# EAGLE board foxBMS_BMS-Slave_12cell (EAGLE 6.5.0), part 1 of 3
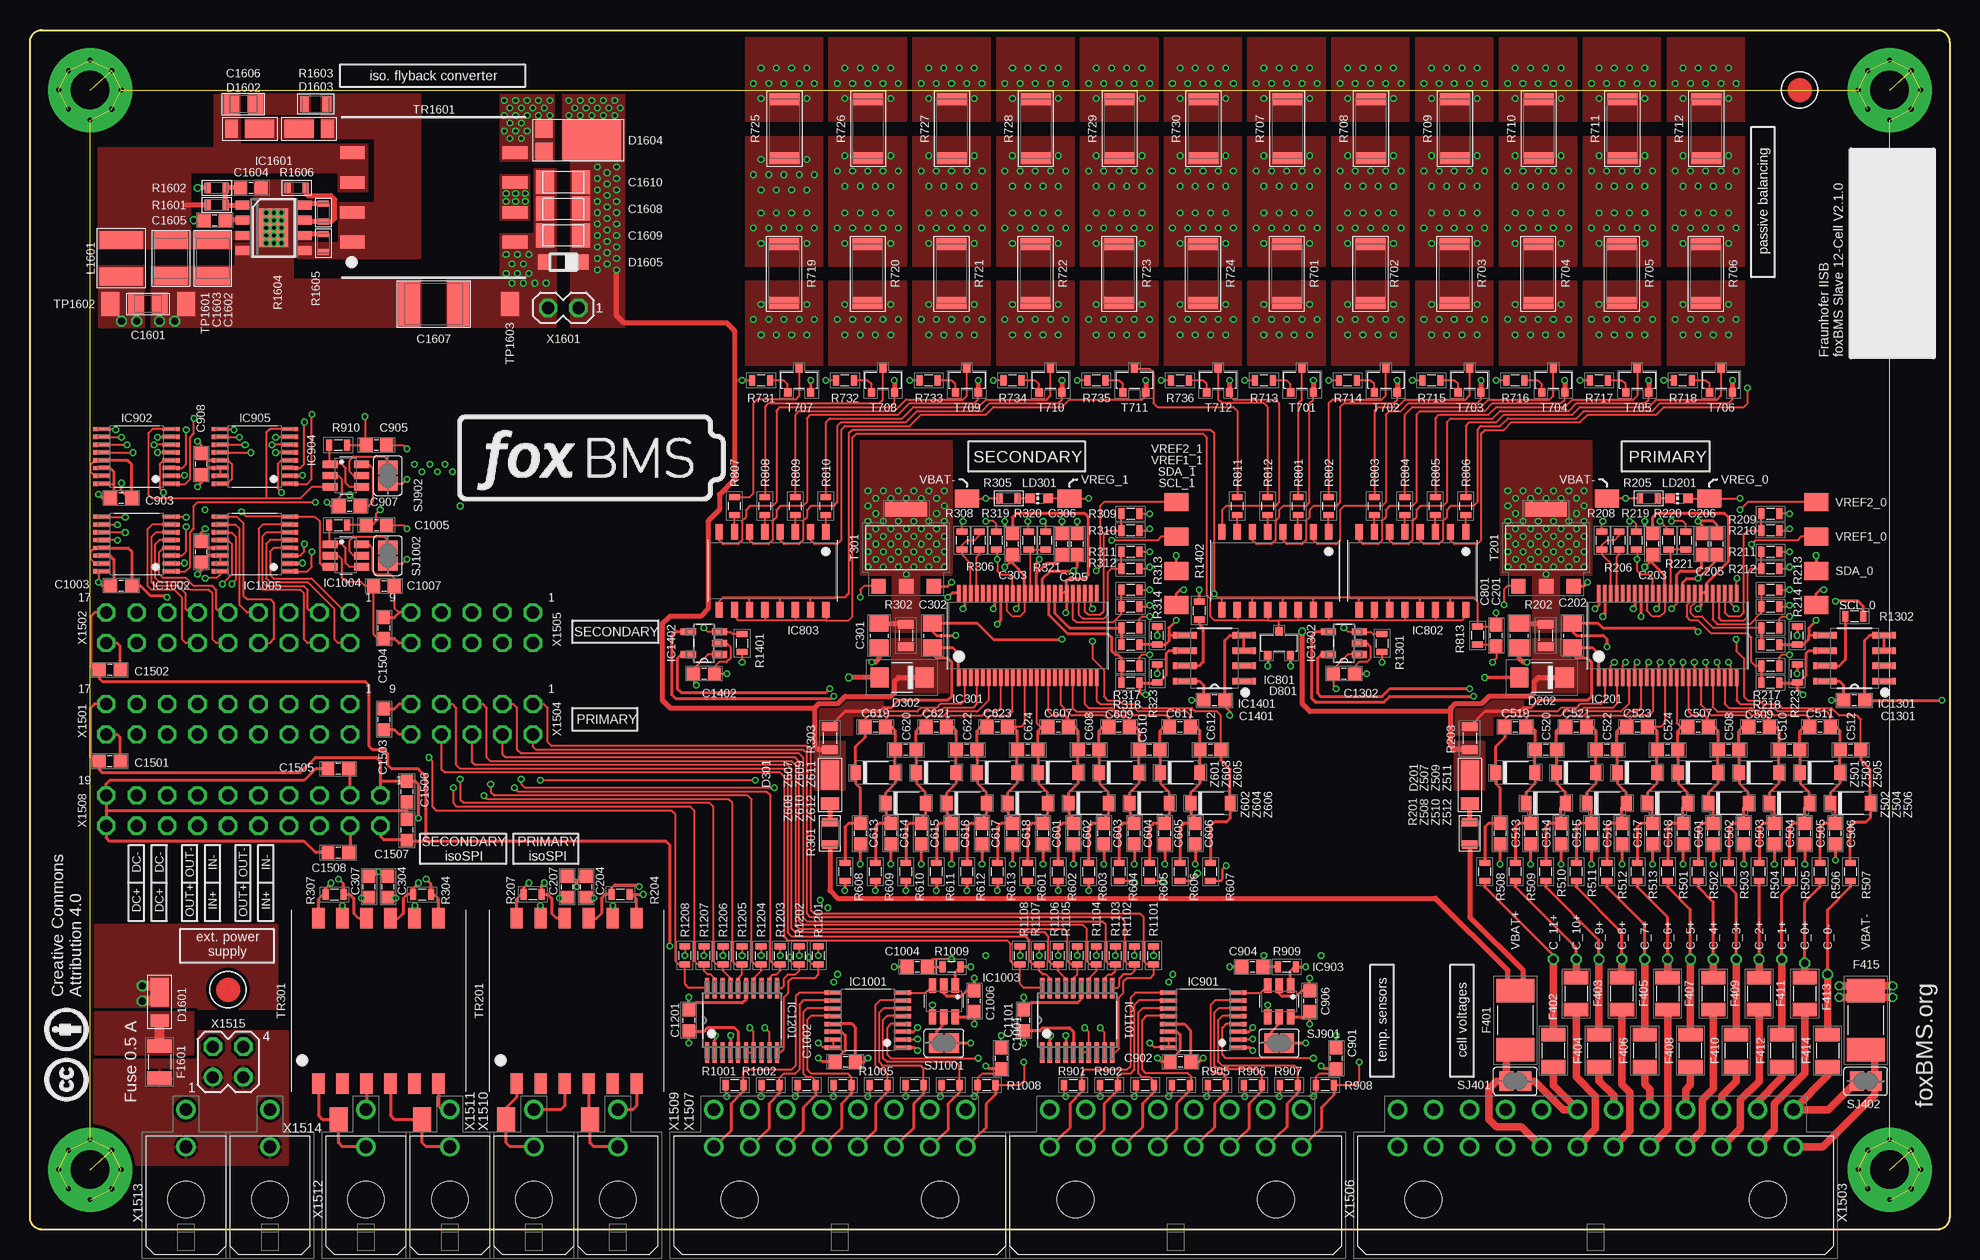
[diagram p24: board, top side]
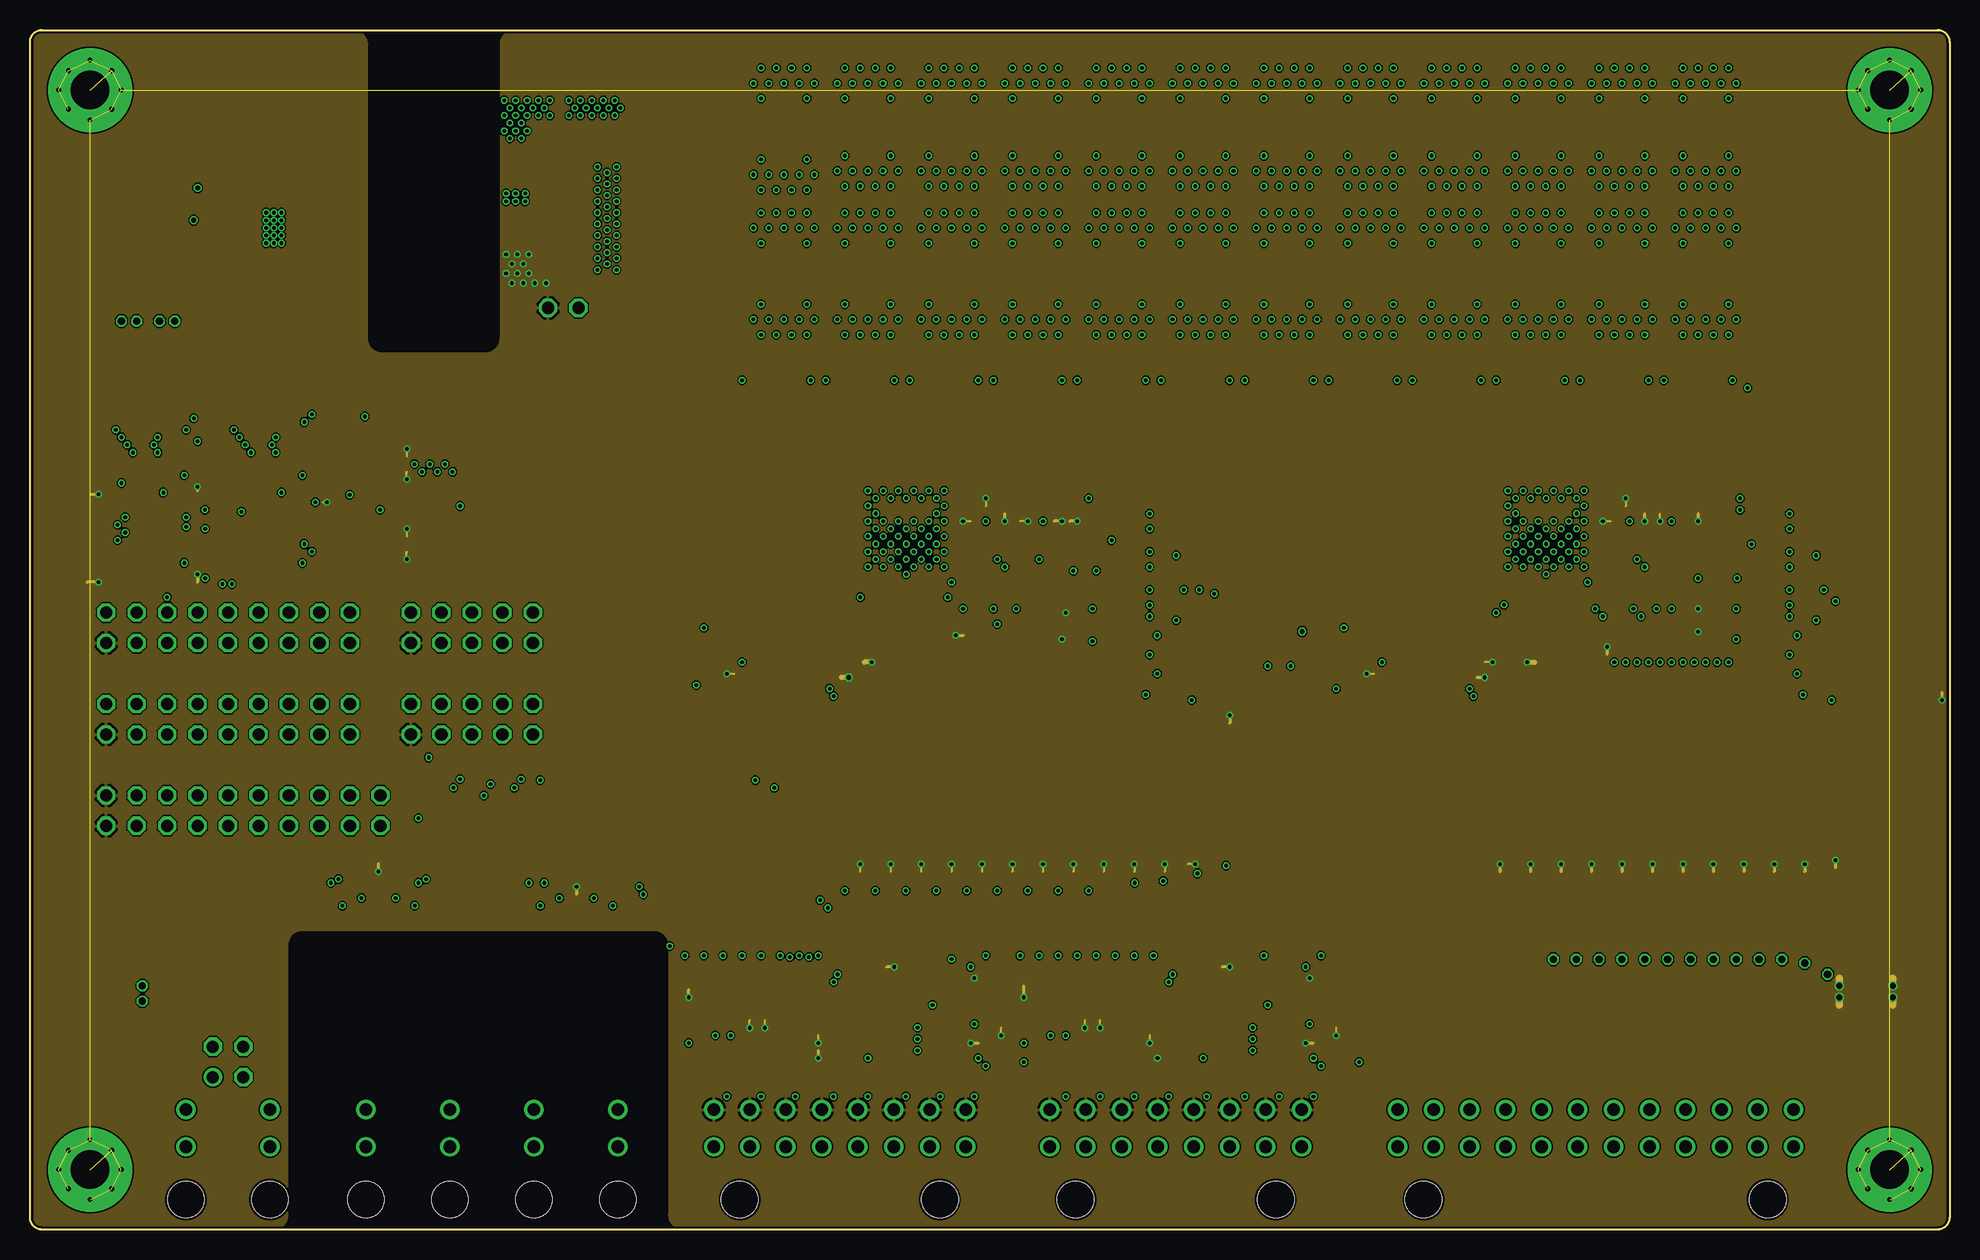
[diagram p25: board, inner layer FUSED_VBAT-]
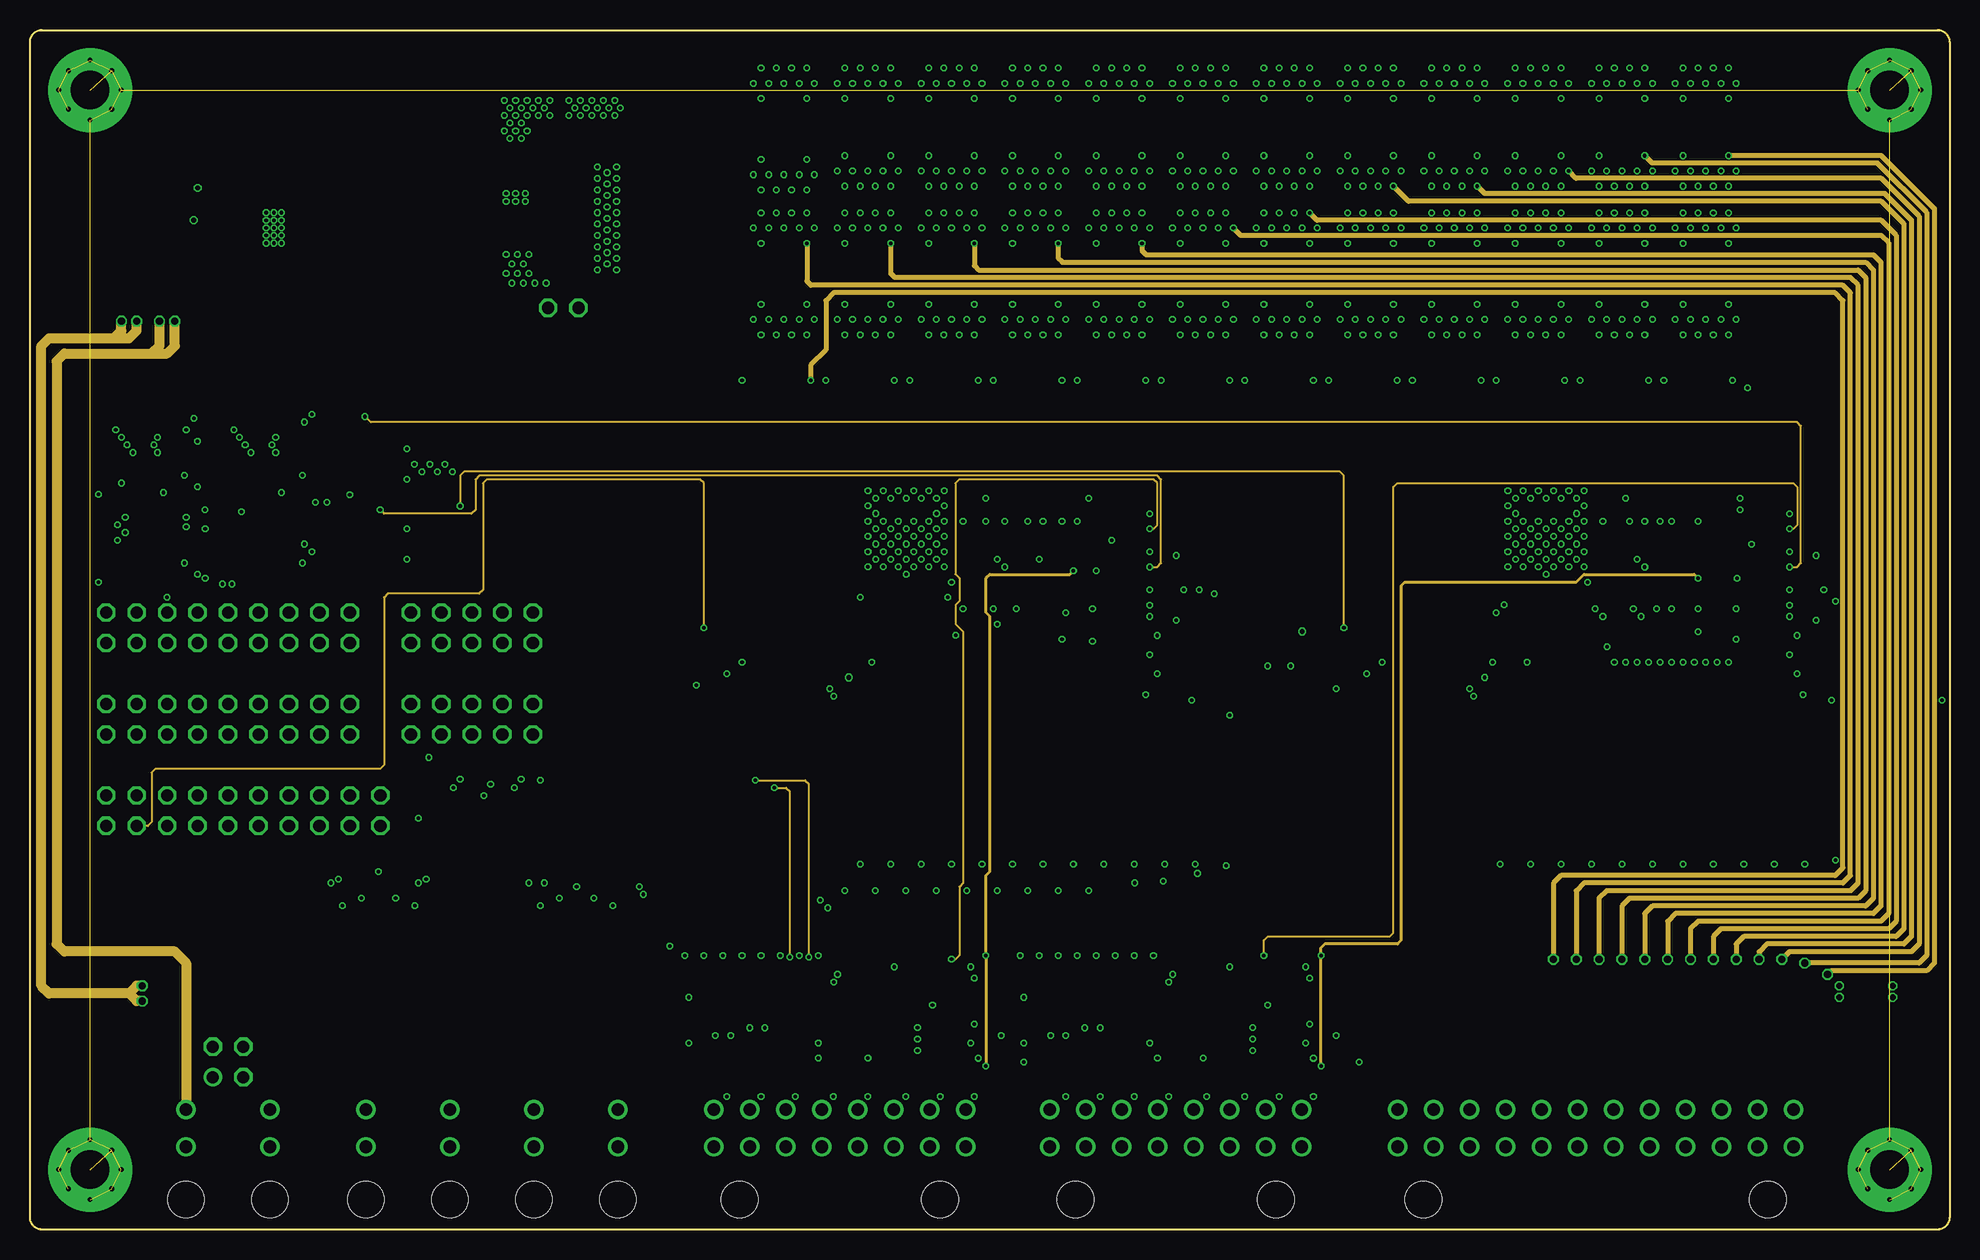
[diagram p26: board, inner layer Signals1]
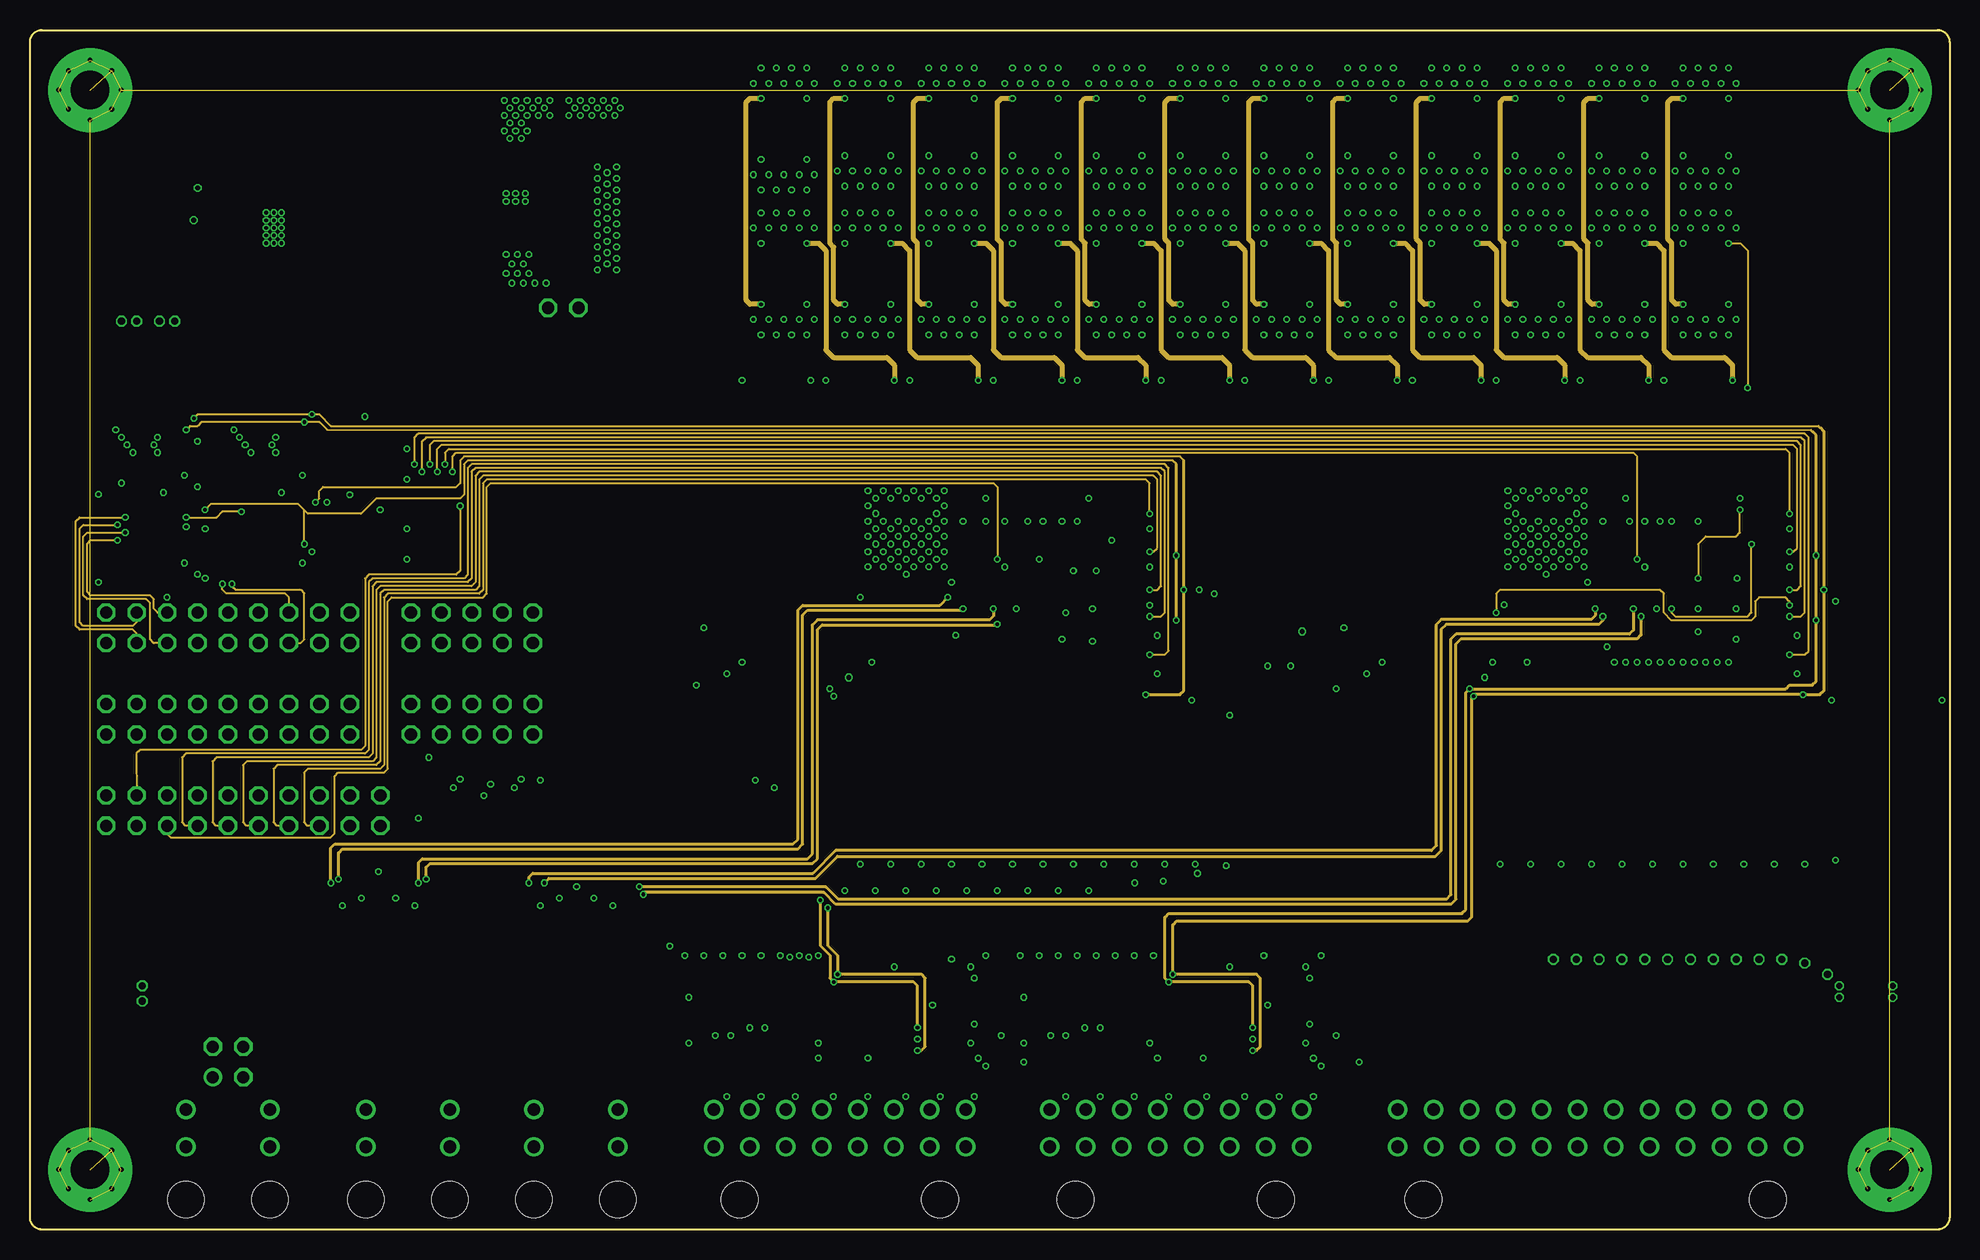
[diagram p27: board, inner layer Signals2]
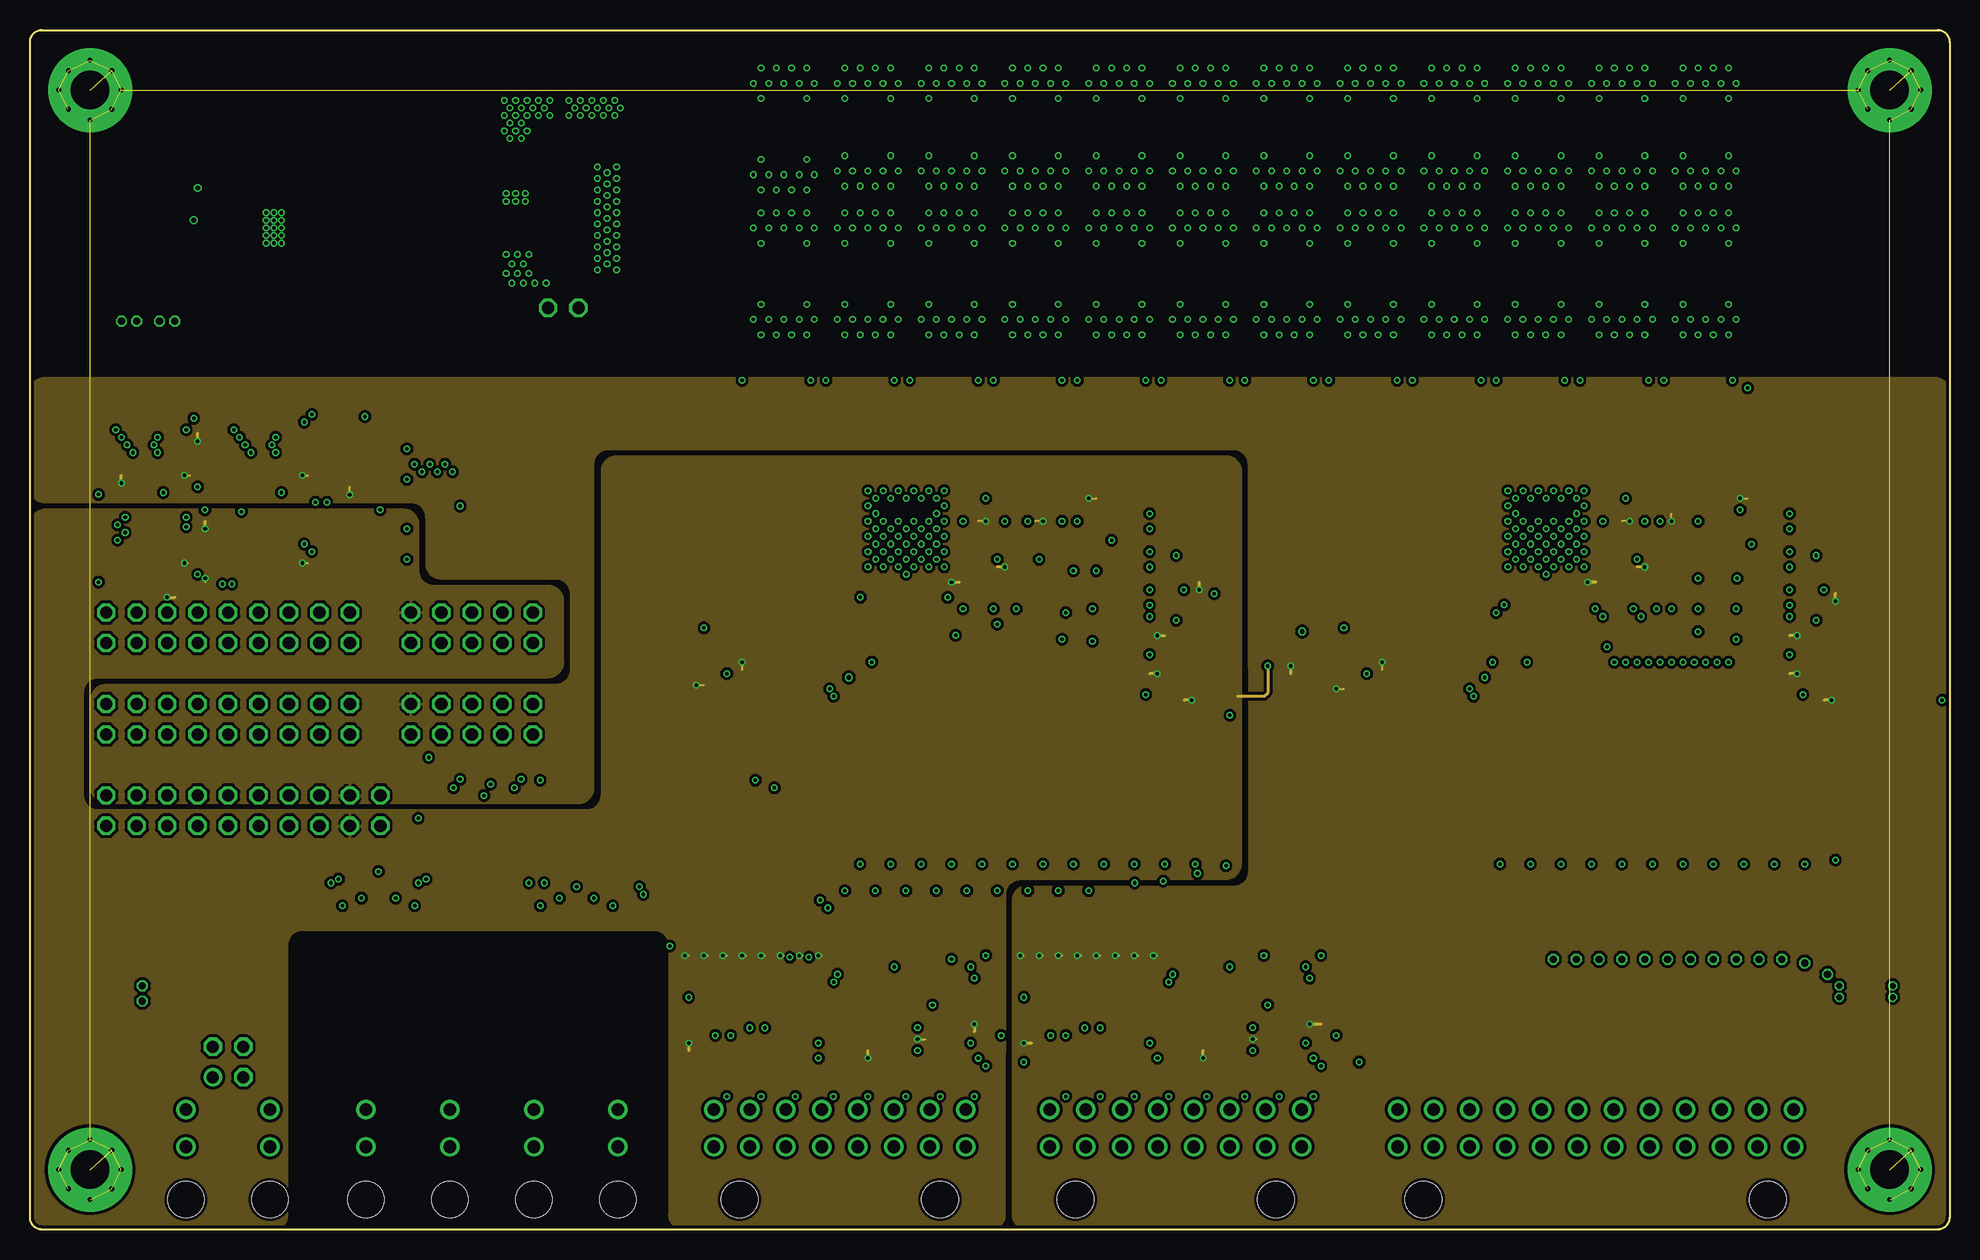
[diagram p28: board, inner layer V_REG]
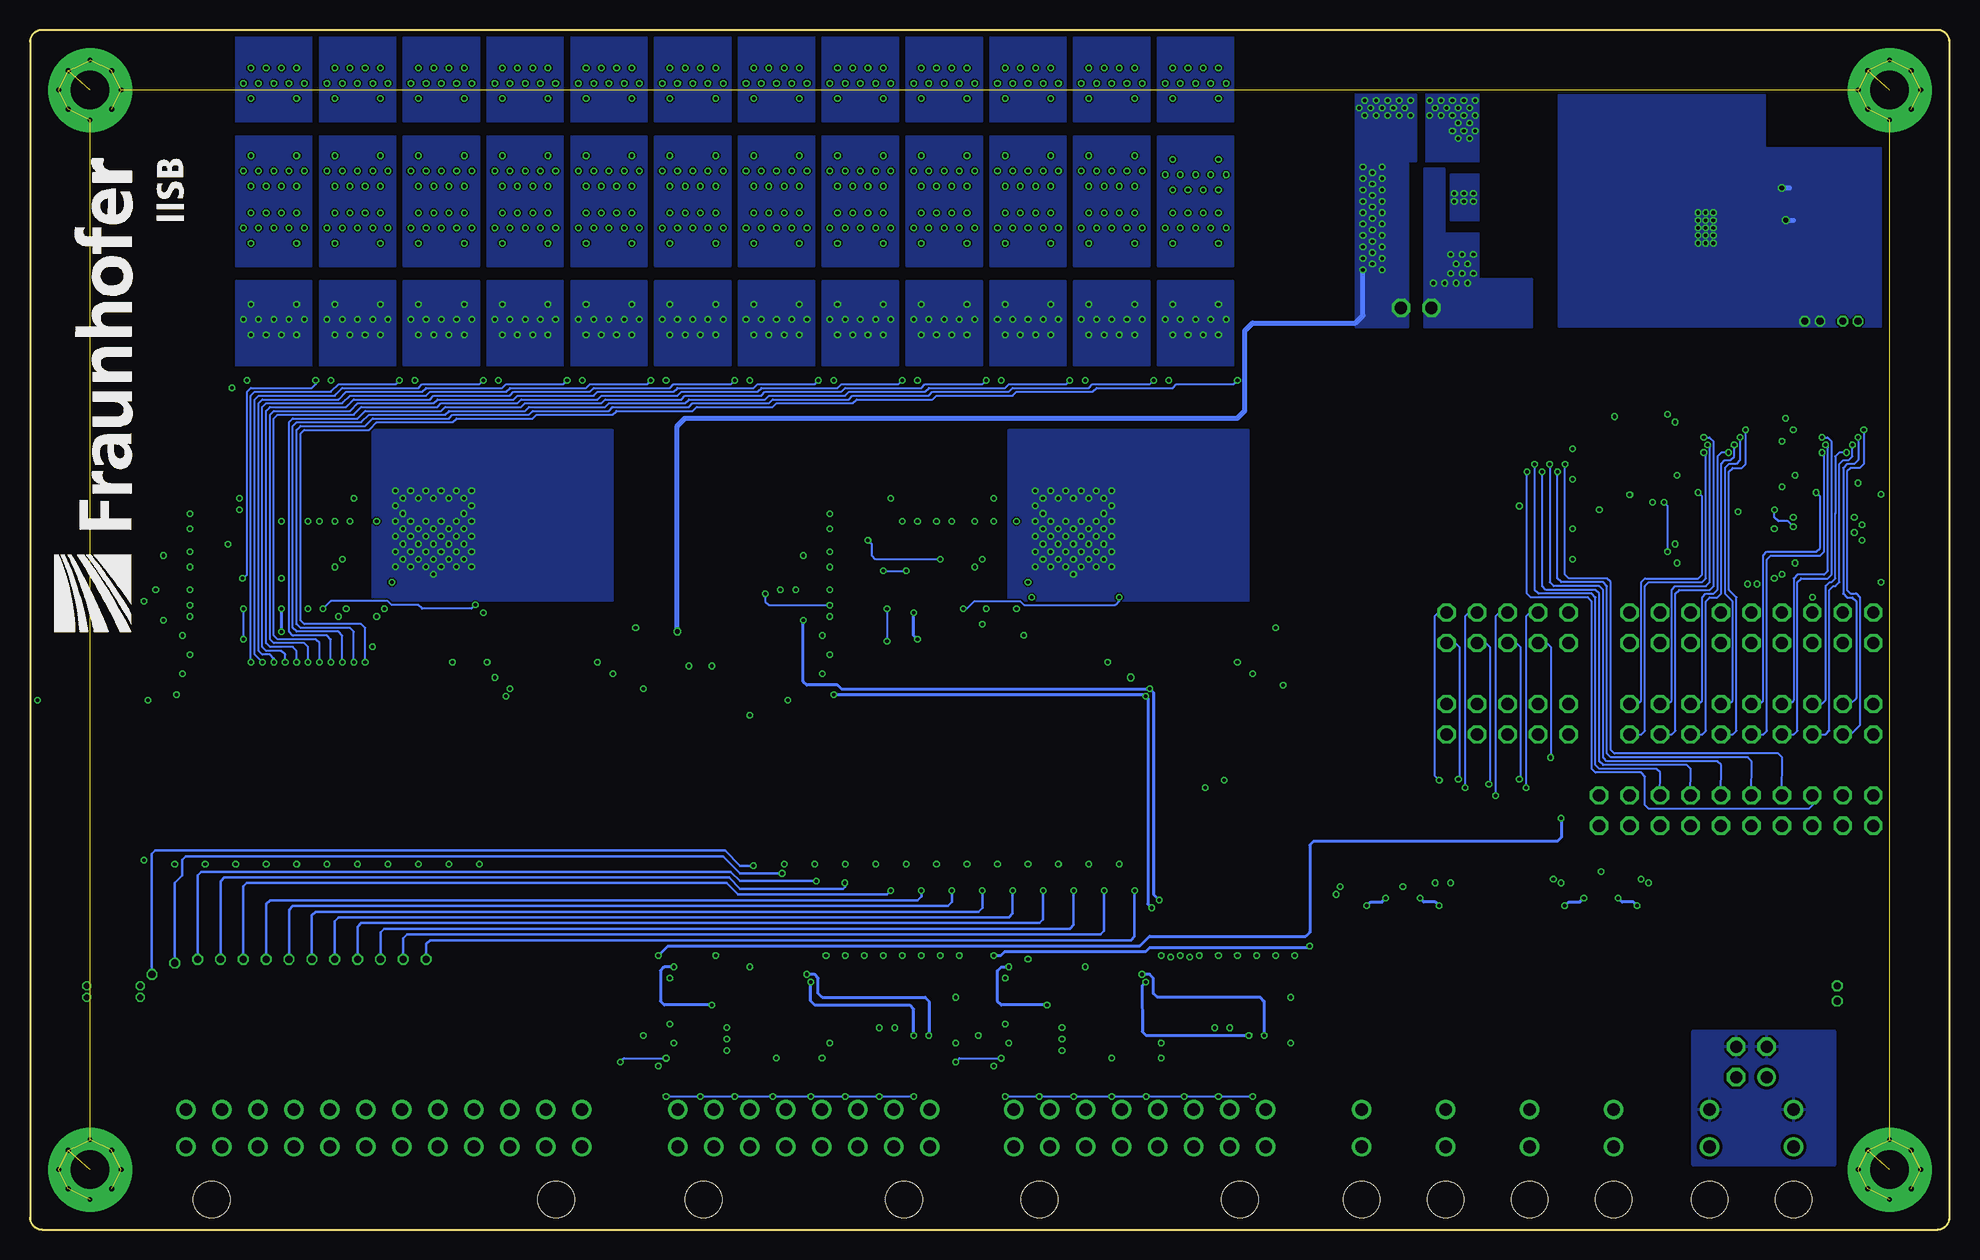
[diagram p29: board, bottom side, seen from below]

Size 160 x 100 mm. Coordinates in mm from the lower left corner, seen from the top.
Outline: 1,100 159,100 arc-90 160,99 160,1 arc-90 159,0 1,0 arc-90 0,1 0,99 arc-90 1,100
Copper layers (1+2*3+4*5+16): Top 0.035mm / dielectric 0.3mm / FUSED_VBAT- 0.035mm / dielectric 0.2mm / Signals1 0.035mm / dielectric 0.3mm / Signals2 0.035mm / dielectric 0.2mm / V_REG 0.035mm / dielectric 0.3mm / Bottom 0.035mm
Design rules "Multi-CB_6L_125um-Tracks_OL35um-IL35um": minimum track width 0.125mm, minimum drill 0.2mm, track to track 0.125mm, track to pad 0.125mm, pad to pad 0.125mm, via to via 0.125mm, smd to smd 0mil, copper to edge 0.2mm, drill to drill 0.2mm, minimum pad ring 0.125mm, minimum via ring 0.125mm, stop-mask expansion 2mil, vias tented up to drill 0.45mm, thermal gap 0.2mm
Net classes: 1 DiffPair: width 0.254 mm
tKeepout: area 153,3 to 157,7; area 3,3 to 7,7; area 151,91 to 159,99; area 3,93 to 7,97; area 155,0 to 160,100; area 0,0 to 5,100; area 5,95 to 155,100

## Footprints (pad centres in the part's own frame; a part is rotated, then mirrored left to right if it is on the bottom)
C_SMD_0805_(2012)_R_MULTICOMP_REV01 = smd 1.3 x 1.6: P$1 -1,0; P$2 1,0
C_SMD_0603_(1608)_R_KEMET_REV01 = smd 1.08 x 1.05: 1 -0.865,0; 2 0.865,0
C_SMD_0805_(2012)_R_KEMET_REV01 = smd 1.3 x 1.6: P$1 -1,0; P$2 1,0
1210 = smd 1.5 x 2.9: P$1 -1.5,0; P$2 1.5,0
1812 = smd 1.8 x 3.7: P$1 -2.05,0; P$2 2.05,0
C_SMD_1206_(3216)_R_KEMET_REV01 = smd 1.5 x 2: P$1 -1.5,0; P$2 1.5,0
POWER_DI_123 = smd 1.5 x 1.05: A 0,-1 | smd 1.5 x 2.4: K 0,1.375
D_SMD_SMA_(DO-214AC)_(BIDIR)_R_VISHAY_REV01 = smd 1.52 x 1.68: A -1.88,0; C 1.88,0
D_SMD_SOT23_(TO-236AB)_R_NXP_REV01 = smd 0.6 x 0.7: 1 -0.95,-1; 2 0.95,-1; 3 0,1
POWER_DI_5 = smd 1.4 x 1.4: A1 -0.92,-3.175; A2 0.92,-3.175 | smd 3.36 x 4.86: K 0,0.807
SOD123 = smd 0.914 x 1.219: A 1.646,0; C -1.646,0
448_SERIES_LITTELFUSE = smd 1.96 x 3.15: P$1 -2.45,0; P$2 2.45,0
R_SMD_CHIP_1206_R_LITTLEFUSE_REV_01 = smd 1.14 x 2.03: P$1 -1.35,0; P$2 1.335,0
0_LES_BATTERIE-MANAGEMENT.SMD_IC_SMD_SSOP-48_(G48)_R_LINEAR_REV01 = smd 0.295 x 1.37: 1 -5.75,-3.535; 2 -5.25,-3.535; 3 -4.75,-3.535; 4 -4.25,-3.535; 5 -3.75,-3.535; 6 -3.25,-3.535; 7 -2.75,-3.535; 8 -2.25,-3.535; 9 -1.75,-3.535; 10 -1.25,-3.535; 11 -0.75,-3.535; 12 -0.25,-3.535; 13 0.25,-3.535; 14 0.75,-3.535; 15 1.25,-3.535; 16 1.75,-3.535; 17 2.25,-3.535; 18 2.75,-3.535; 19 3.25,-3.535; 20 3.75,-3.535; 21 4.25,-3.535; 22 4.75,-3.535; 23 5.25,-3.535; 24 5.75,-3.535; 25 5.75,3.535; 26 5.25,3.535; 27 4.75,3.535; 28 4.25,3.535; 29 3.75,3.535; 30 3.25,3.535; 31 2.75,3.535; 32 2.25,3.535; 33 1.75,3.535; 34 1.25,3.535; 35 0.75,3.535; 36 0.25,3.535; 37 -0.25,3.535; 38 -0.75,3.535; 39 -1.25,3.535; 40 -1.75,3.535; 41 -2.25,3.535; 42 -2.75,3.535; 43 -3.25,3.535; 44 -3.75,3.535; 45 -4.25,3.535; 46 -4.75,3.535; 47 -5.25,3.535; 48 -5.75,3.535
OC_SMD_SOIC-16_R_AVAGO_REV01 = smd 0.6 x 1.3: 1 -4.445,-3.24; 2 -3.175,-3.24; 3 -1.905,-3.24; 4 -0.635,-3.24; 5 0.635,-3.24; 6 1.905,-3.24; 7 3.175,-3.24; 8 4.445,-3.24; 9 4.445,3.24; 10 3.175,3.24; 11 1.905,3.24; 12 0.635,3.24; 13 -0.635,3.24; 14 -1.905,3.24; 15 -3.175,3.24; 16 -4.445,3.24
SOP65P638X110-16N = smd 1.422 x 0.356: 1 -2.896,2.286; 2 -2.896,1.626; 3 -2.896,0.965; 4 -2.896,0.33; 5 -2.896,-0.33; 6 -2.896,-0.965; 7 -2.896,-1.626; 8 -2.896,-2.286; 9 2.896,-2.286; 10 2.896,-1.626; 11 2.896,-0.965; 12 2.896,-0.33; 13 2.896,0.33; 14 2.896,0.965; 15 2.896,1.626; 16 2.896,2.286
IC_SMD_TSOT-23-6_(S6)_R_LINEAR_REV01 = smd 0.62 x 1.22: 1 -0.95,-1.31; 2 0,-1.31; 3 0.95,-1.31; 4 0.95,1.31; 5 0,1.31; 6 -0.95,1.31
SOP65P640X150-20N = smd 1.702 x 0.356: 1 -2.692,2.921; 2 -2.692,2.286; 3 -2.692,1.626; 4 -2.692,0.965; 5 -2.692,0.33; 6 -2.692,-0.33; 7 -2.692,-0.965; 8 -2.692,-1.626; 9 -2.692,-2.286; 10 -2.692,-2.921; 11 2.692,-2.921; 12 2.692,-2.286; 13 2.692,-1.626; 14 2.692,-0.965; 15 2.692,-0.33; 16 2.692,0.33; 17 2.692,0.965; 18 2.692,1.626; 19 2.692,2.286; 20 2.692,2.921
SOIC127P600X175-8N = smd 1.981 x 0.533: 1 -2.464,1.905; 2 -2.464,0.635; 3 -2.464,-0.635; 4 -2.464,-1.905; 5 2.464,-1.905; 6 2.464,-0.635; 7 2.464,0.635; 8 2.464,1.905
SOT95P280X145-5N = smd 1.27 x 0.559: 1 -1.295,0.94; 2 -1.295,0; 3 -1.295,-0.94; 4 1.295,-0.94; 5 1.295,0.94
S8E = smd 0.76 x 1.143: 1 -1.905,-2.602; 2 -0.635,-2.602; 3 0.635,-2.602; 4 1.905,-2.602; 5 1.905,2.602; 6 0.635,2.602; 7 -0.635,2.602; 8 -1.905,2.602 | smd 3.2 x 2.4: P$1 0,0
WE-LQS = smd 1.5 x 3.6: 1 -1.525,0; 2 1.525,0
CHIP-LED0603 = smd 0.8 x 0.8: A 0,-0.75; C 0,0.75
R_SMD_0805_R_VISHAY_REV01 = smd 0.7 x 1.3: 1 -0.95,0; 2 0.95,0
R_SMD_0603_R_VISHAY_REV01 = smd 0.5 x 0.9: 1 -0.75,0; 2 0.75,0
R_SMD_2010_R_YAGEO_REV01 = smd 1 x 2.5: P$1 -2.45,0; P$2 2.45,0
SJ = smd 1.168 x 1.6: 1 -0.762,0; 2 0.762,0
CUSTOM_JUMPER_SJ = smd 1.168 x 1.6: 1 -0.66,0; 2 0.66,0
D_SMD_SOT223_(SC-73)_R_NXP_REV01 = smd 1.2 x 1.2: 1 -2.3,-3.2; 2 0,-3.2; 3 2.3,-3.2 | smd 3.5 x 1.2: 4 0,3.2
CUSTOM_PAD_PAD2.0X1.5MM = smd 2 x 1.5: P$1 0,0
HM2102NL = smd 1.02 x 1.71: 1 -5,-6.89; 2 -3,-6.89; 3 -1,-6.89; 4 1,-6.89; 5 3,-6.89; 6 5,-6.89; 7 5,6.89; 8 3,6.89; 9 1,6.89; 10 -1,6.89; 11 -3,6.89; 12 -5,6.89
WUERTH_CUSTOM = smd 1.07 x 2.08: 1 3.735,-6.78; 2 1.245,-6.78; 3 -1.245,-6.78; 4 -3.735,-6.78; 5 -3.735,6.78; 6 -1.245,6.78; 7 1.245,6.78; 8 3.735,6.78
MA09-2 = drill 1.016 octagon: 1 -10.16,-1.27; 2 -10.16,1.27; 3 -7.62,-1.27; 4 -7.62,1.27; 5 -5.08,-1.27; 6 -5.08,1.27; 7 -2.54,-1.27; 8 -2.54,1.27; 9 0,-1.27; 10 0,1.27; 11 2.54,-1.27; 12 2.54,1.27; 13 5.08,-1.27; 14 5.08,1.27; 15 7.62,-1.27; 16 7.62,1.27; 17 10.16,-1.27; 18 10.16,1.27
X_TH_MOLEX_43045-2400_R_REV01 = drill 1.07: 1 16.5,4.4; 2 13.5,4.4; 3 10.5,4.4; 4 7.5,4.4; 5 4.5,4.4; 6 1.5,4.4; 7 -1.5,4.4; 8 -4.5,4.4; 9 -7.5,4.4; 10 -10.5,4.4; 11 -13.5,4.4; 12 -16.5,4.4; 13 16.5,7.5; 14 13.5,7.5; 15 10.5,7.5; 16 7.5,7.5; 17 4.5,7.5; 18 1.5,7.5; 19 -1.5,7.5; 20 -4.5,7.5; 21 -7.5,7.5; 22 -10.5,7.5; 23 -13.5,7.5; 24 -16.5,7.5 | hole 3.05: 14.35,0; -14.35,0
MA05-2 = drill 1.016 pad 1.524 octagon: 1 -5.08,-1.27; 2 -5.08,1.27; 3 -2.54,-1.27; 4 -2.54,1.27; 5 0,-1.27; 6 0,1.27; 7 2.54,-1.27; 8 2.54,1.27; 9 5.08,-1.27; 10 5.08,1.27
X_TH_MOLEX_43045-1600_R_REV01 = drill 1.07: 1 10.5,4.4; 2 7.5,4.4; 3 4.5,4.4; 4 1.5,4.4; 5 -1.5,4.4; 6 -4.5,4.4; 7 -7.5,4.4; 8 -10.5,4.4; 9 10.5,7.5; 10 7.5,7.5; 11 4.5,7.5; 12 1.5,7.5; 13 -1.5,7.5; 14 -4.5,7.5; 15 -7.5,7.5; 16 -10.5,7.5 | hole 3.05: 8.35,0; -8.35,0
MA10-2 = drill 1.016 pad 1.524 octagon: 1 -11.43,-1.27; 2 -11.43,1.27; 3 -8.89,-1.27; 4 -8.89,1.27; 5 -6.35,-1.27; 6 -6.35,1.27; 7 -3.81,-1.27; 8 -3.81,1.27; 9 -1.27,-1.27; 10 -1.27,1.27; 11 1.27,-1.27; 12 1.27,1.27; 13 3.81,-1.27; 14 3.81,1.27; 15 6.35,-1.27; 16 6.35,1.27; 17 8.89,-1.27; 18 8.89,1.27; 19 11.43,-1.27; 20 11.43,1.27
X_TH_MOLEX_43045-0200_R_REV01 = drill 1.07: 1 0,4.4; 2 0,7.5 | hole 3.05: 0,0
MA02-2 = drill 1.016: 1 -1.27,-1.27 | drill 1.016 octagon: 2 -1.27,1.27; 3 1.27,-1.27; 4 1.27,1.27
MA02-1A = drill 1.016 octagon: 1 -1.27,0; 2 1.27,0
D_SMD_SOD-123_R_ON_REV01 = smd 0.91 x 1.22: A -1.635,0; K 1.635,0

## Placement (x,y rotation side)
C201  100nF, 10%, 100V  [C_SMD_0805_(2012)_R_MULTICOMP_REV01]  124.12,49.52 270 top
C202  100nF, 10%, 100V  [C_SMD_0805_(2012)_R_MULTICOMP_REV01]  128.57,49.52 90 top
C203  1uF, 20%, 16V  [C_SMD_0603_(1608)_R_KEMET_REV01]  135.24,57.14 270 top
C204  100pF, 15%, 25V  [C_SMD_0603_(1608)_R_KEMET_REV01]  46.35,28.57 270 top
C205  1uF, 20%, 16V  [C_SMD_0603_(1608)_R_KEMET_REV01]  140.63,57.14 270 top
C206  1uF, 20%, 16V  [C_SMD_0603_(1608)_R_KEMET_REV01]  139.36,57.14 270 top
C207  100pF, 15%, 25V  [C_SMD_0603_(1608)_R_KEMET_REV01]  44.77,28.57 270 top
C301  100nF, 10%, 100V  [C_SMD_0805_(2012)_R_MULTICOMP_REV01]  70.78,49.52 270 top
C302  100nF, 10%, 100V  [C_SMD_0805_(2012)_R_MULTICOMP_REV01]  75.23,49.52 90 top
C303  1uF, 20%, 16V  [C_SMD_0603_(1608)_R_KEMET_REV01]  81.89,57.14 270 top
C304  100pF, 15%, 25V  [C_SMD_0603_(1608)_R_KEMET_REV01]  29.84,28.57 270 top
C305  1uF, 20%, 16V  [C_SMD_0603_(1608)_R_KEMET_REV01]  87.29,57.14 270 top
C306  1uF, 20%, 16V  [C_SMD_0603_(1608)_R_KEMET_REV01]  86.02,57.14 270 top
C307  100pF, 15%, 25V  [C_SMD_0603_(1608)_R_KEMET_REV01]  28.26,28.57 270 top
C501  10nF, 100V, 10%  [C_SMD_0603_(1608)_R_KEMET_REV01]  137.78,33.01 270 top
C502  10nF, 100V, 10%  [C_SMD_0603_(1608)_R_KEMET_REV01]  140.31,33.01 270 top
C503  10nF, 100V, 10%  [C_SMD_0603_(1608)_R_KEMET_REV01]  142.85,33.01 270 top
C504  10nF, 100V, 10%  [C_SMD_0603_(1608)_R_KEMET_REV01]  145.4,33.01 270 top
C505  10nF, 100V, 10%  [C_SMD_0603_(1608)_R_KEMET_REV01]  147.94,33.01 270 top
C506  10nF, 100V, 10%  [C_SMD_0603_(1608)_R_KEMET_REV01]  150.47,33.01 270 top
C507  10nF, 100V, 10%  [C_SMD_0603_(1608)_R_KEMET_REV01]  139.04,41.9 0 top
C508  10nF, 100V, 10%  [C_SMD_0603_(1608)_R_KEMET_REV01]  141.59,39.99 0 top
C509  10nF, 100V, 10%  [C_SMD_0603_(1608)_R_KEMET_REV01]  144.12,41.9 0 top
C510  10nF, 100V, 10%  [C_SMD_0603_(1608)_R_KEMET_REV01]  146.66,39.99 0 top
C511  10nF, 100V, 10%  [C_SMD_0603_(1608)_R_KEMET_REV01]  149.21,41.9 0 top
C512  10nF, 100V, 10%  [C_SMD_0603_(1608)_R_KEMET_REV01]  151.75,39.99 0 top
C513  10nF, 100V, 10%  [C_SMD_0603_(1608)_R_KEMET_REV01]  122.53,33.01 270 top
C514  10nF, 100V, 10%  [C_SMD_0603_(1608)_R_KEMET_REV01]  125.08,33.01 270 top
C515  10nF, 100V, 10%  [C_SMD_0603_(1608)_R_KEMET_REV01]  127.61,33.01 270 top
C516  10nF, 100V, 10%  [C_SMD_0603_(1608)_R_KEMET_REV01]  130.16,33.01 270 top
C517  10nF, 100V, 10%  [C_SMD_0603_(1608)_R_KEMET_REV01]  132.69,33.01 270 top
C518  10nF, 100V, 10%  [C_SMD_0603_(1608)_R_KEMET_REV01]  135.24,33.01 270 top
C519  10nF, 100V, 10%  [C_SMD_0603_(1608)_R_KEMET_REV01]  123.81,41.9 0 top
C520  10nF, 100V, 10%  [C_SMD_0603_(1608)_R_KEMET_REV01]  126.34,39.99 0 top
C521  10nF, 100V, 10%  [C_SMD_0603_(1608)_R_KEMET_REV01]  128.88,41.9 0 top
C522  10nF, 100V, 10%  [C_SMD_0603_(1608)_R_KEMET_REV01]  131.43,39.99 0 top
C523  10nF, 100V, 10%  [C_SMD_0603_(1608)_R_KEMET_REV01]  133.97,41.9 0 top
C524  10nF, 100V, 10%  [C_SMD_0603_(1608)_R_KEMET_REV01]  136.5,39.99 0 top
C601  10nF, 100V, 10%  [C_SMD_0603_(1608)_R_KEMET_REV01]  84.44,33.01 270 top
C602  10nF, 100V, 10%  [C_SMD_0603_(1608)_R_KEMET_REV01]  86.97,33.01 270 top
C603  10nF, 100V, 10%  [C_SMD_0603_(1608)_R_KEMET_REV01]  89.52,33.01 270 top
C604  10nF, 100V, 10%  [C_SMD_0603_(1608)_R_KEMET_REV01]  92.06,33.01 270 top
C605  10nF, 100V, 10%  [C_SMD_0603_(1608)_R_KEMET_REV01]  94.59,33.01 270 top
C606  10nF, 100V, 10%  [C_SMD_0603_(1608)_R_KEMET_REV01]  97.14,33.01 270 top
C607  10nF, 100V, 10%  [C_SMD_0603_(1608)_R_KEMET_REV01]  85.7,41.9 0 top
C608  10nF, 100V, 10%  [C_SMD_0603_(1608)_R_KEMET_REV01]  88.25,39.99 0 top
C609  10nF, 100V, 10%  [C_SMD_0603_(1608)_R_KEMET_REV01]  90.78,41.9 0 top
C610  10nF, 100V, 10%  [C_SMD_0603_(1608)_R_KEMET_REV01]  93.33,39.99 0 top
C611  10nF, 100V, 10%  [C_SMD_0603_(1608)_R_KEMET_REV01]  95.86,41.9 0 top
C612  10nF, 100V, 10%  [C_SMD_0603_(1608)_R_KEMET_REV01]  98.41,39.99 0 top
C613  10nF, 100V, 10%  [C_SMD_0603_(1608)_R_KEMET_REV01]  69.19,33.01 270 top
C614  10nF, 100V, 10%  [C_SMD_0603_(1608)_R_KEMET_REV01]  71.73,33.01 270 top
C615  10nF, 100V, 10%  [C_SMD_0603_(1608)_R_KEMET_REV01]  74.28,33.01 270 top
C616  10nF, 100V, 10%  [C_SMD_0603_(1608)_R_KEMET_REV01]  76.81,33.01 270 top
C617  10nF, 100V, 10%  [C_SMD_0603_(1608)_R_KEMET_REV01]  79.36,33.01 270 top
C618  10nF, 100V, 10%  [C_SMD_0603_(1608)_R_KEMET_REV01]  81.89,33.01 270 top
C619  10nF, 100V, 10%  [C_SMD_0603_(1608)_R_KEMET_REV01]  70.47,41.9 0 top
C620  10nF, 100V, 10%  [C_SMD_0603_(1608)_R_KEMET_REV01]  73,39.99 0 top
C621  10nF, 100V, 10%  [C_SMD_0603_(1608)_R_KEMET_REV01]  75.55,41.9 0 top
C622  10nF, 100V, 10%  [C_SMD_0603_(1608)_R_KEMET_REV01]  78.08,39.99 0 top
C623  10nF, 100V, 10%  [C_SMD_0603_(1608)_R_KEMET_REV01]  80.62,41.9 0 top
C624  10nF, 100V, 10%  [C_SMD_0603_(1608)_R_KEMET_REV01]  83.17,39.99 0 top
C801  100nF, 20%, 16V  [C_SMD_0603_(1608)_R_KEMET_REV01]  122.22,49.52 90 top
C901  100nF, 20%, 16V  [C_SMD_0603_(1608)_R_KEMET_REV01]  108.88,14.28 270 top
C902  1uF, 20%, 16V  [C_SMD_0603_(1608)_R_KEMET_REV01]  95.91,13.98 0 top
C903  1uF, 20%, 16V  [C_SMD_0603_(1608)_R_KEMET_REV01]  7.61,60.98 0 top
C904  10nF, 100V, 10%  [C_SMD_0603_(1608)_R_KEMET_REV01]  101.9,21.89 0 top
C905  10nF, 100V, 10%  [C_SMD_0603_(1608)_R_KEMET_REV01]  28.87,65.39 180 top
C906  1uF, 20%, 16V  [C_SMD_0603_(1608)_R_KEMET_REV01]  106.66,19.04 270 top
C907  1uF, 20%, 16V  [C_SMD_0603_(1608)_R_KEMET_REV01]  26.65,60.31 0 top
C908  1uF, 20%, 16V  [C_SMD_0603_(1608)_R_KEMET_REV01]  14.27,63.8 90 top
C1001  100nF, 20%, 16V  [C_SMD_0603_(1608)_R_KEMET_REV01]  80.94,14.28 270 top
C1002  1uF, 20%, 16V  [C_SMD_0603_(1608)_R_KEMET_REV01]  67.97,13.98 0 top
C1003  1uF, 20%, 16V  [C_SMD_0603_(1608)_R_KEMET_REV01]  7.61,53.68 0 top
C1004  10nF, 100V, 10%  [C_SMD_0603_(1608)_R_KEMET_REV01]  73.96,21.89 0 top
C1005  10nF, 100V, 10%  [C_SMD_0603_(1608)_R_KEMET_REV01]  28.87,58.73 180 top
C1006  1uF, 20%, 16V  [C_SMD_0603_(1608)_R_KEMET_REV01]  78.72,19.04 270 top
C1007  1uF, 20%, 16V  [C_SMD_0603_(1608)_R_KEMET_REV01]  29.51,53.65 0 top
C1008  1uF, 20%, 16V  [C_SMD_0603_(1608)_R_KEMET_REV01]  14.27,56.5 90 top
C1101  100nF, 20%, 16V  [C_SMD_0603_(1608)_R_KEMET_REV01]  82.85,17.45 270 top
C1201  100nF, 20%, 16V  [C_SMD_0603_(1608)_R_KEMET_REV01]  54.91,17.45 270 top
C1301  100nF, 20%, 16V  [C_SMD_0603_(1608)_R_KEMET_REV01]  152.06,44.12 180 top
C1302  100nF, 20%, 16V  [C_SMD_0603_(1608)_R_KEMET_REV01]  109.52,46.34 180 top
C1401  100nF, 20%, 16V  [C_SMD_0603_(1608)_R_KEMET_REV01]  98.72,44.12 180 top
C1402  100nF, 20%, 16V  [C_SMD_0603_(1608)_R_KEMET_REV01]  56.18,46.34 180 top
C1501  100nF, 20%, 16V  [C_SMD_0603_(1608)_R_KEMET_REV01]  6.65,39.04 180 top
C1502  100nF, 20%, 16V  [C_SMD_0603_(1608)_R_KEMET_REV01]  6.65,46.66 180 top
C1503  100nF, 20%, 16V  [C_SMD_0603_(1608)_R_KEMET_REV01]  29.51,42.53 90 top
C1504  100nF, 20%, 16V  [C_SMD_0603_(1608)_R_KEMET_REV01]  29.51,50.15 90 top
C1505  100nF, 20%, 16V  [C_SMD_0603_(1608)_R_KEMET_REV01]  25.7,38.41 0 top
C1506  100nF, 20%, 16V  [C_SMD_0603_(1608)_R_KEMET_REV01]  31.41,36.5 90 top
C1507  100nF, 20%, 16V  [C_SMD_0603_(1608)_R_KEMET_REV01]  31.41,33.33 270 top
C1508  100nF, 20%, 16V  [C_SMD_0603_(1608)_R_KEMET_REV01]  25.7,31.42 0 top
C1601  1,00µF_0805_25V_X7R_KEMET  [C_SMD_0805_(2012)_R_KEMET_REV01]  9.84,77.15 180 top
C1602  10µF_1210_25V_X7R  [1210]  15.24,80.96 90 top
C1603  10µF_1210_25V_X7R  [1210]  11.75,80.96 90 top
C1604  100nF, 20%, 16V  [C_SMD_0603_(1608)_R_KEMET_REV01]  18.41,86.84 180 top
C1605  1uF, 20%, 16V  [C_SMD_0603_(1608)_R_KEMET_REV01]  15.4,84.14 0 top
C1606  470PF_0805_50V_X7R_KEMET  [C_SMD_0805_(2012)_R_KEMET_REV01]  17.78,93.82 180 top
C1607  4,7NF_1812  [1812]  33.66,77.15 0 top
C1608  4,70µF_1206_25V_X7R_KEMET  [C_SMD_1206_(3216)_R_KEMET_REV01]  44.45,85.09 0 top
C1609  4,70µF_1206_25V_X7R_KEMET  [C_SMD_1206_(3216)_R_KEMET_REV01]  44.45,82.87 0 top
C1610  4,70µF_1206_25V_X7R_KEMET  [C_SMD_1206_(3216)_R_KEMET_REV01]  44.45,87.31 0 top
D201  DI_DFLS1100  [POWER_DI_123]  120.02,36.51 0 top
D202  SMAJ60CA_VISHAY  [D_SMD_SMA_(DO-214AC)_(BIDIR)_R_VISHAY_REV01]  126.03,46.02 0 top
D301  DI_DFLS1100  [POWER_DI_123]  66.67,36.51 0 top
D302  SMAJ60CA_VISHAY  [D_SMD_SMA_(DO-214AC)_(BIDIR)_R_VISHAY_REV01]  72.69,46.02 0 top
D801  BAT54C  [D_SMD_SOT23_(TO-236AB)_R_NXP_REV01]  104.12,48.88 0 top
D1601  DI_DFLS1100  [POWER_DI_123]  10.79,18.41 0 top
D1602  DI_DFLZ36  [POWER_DI_123]  17.78,91.76 270 top
D1603  DI_DFLS1100  [POWER_DI_123]  23.81,91.76 90 top
D1604  DI_PDS3200  [POWER_DI_5]  46.04,90.81 270 top
D1605  MMSZ5263B  [SOD123]  44.45,80.64 180 top
F401  0.5A, 63V, 0.25R  [448_SERIES_LITTELFUSE]  123.81,17.45 90 top
F402  FUSE: 0.250A, 32V, 0.57R  [R_SMD_CHIP_1206_R_LITTLEFUSE_REV_01]  126.98,14.91 90 top
F403  FUSE: 0.250A, 32V, 0.57R  [R_SMD_CHIP_1206_R_LITTLEFUSE_REV_01]  128.88,19.67 90 top
F404  FUSE: 0.250A, 32V, 0.57R  [R_SMD_CHIP_1206_R_LITTLEFUSE_REV_01]  130.79,14.91 90 top
F405  FUSE: 0.250A, 32V, 0.57R  [R_SMD_CHIP_1206_R_LITTLEFUSE_REV_01]  132.69,19.67 90 top
F406  FUSE: 0.250A, 32V, 0.57R  [R_SMD_CHIP_1206_R_LITTLEFUSE_REV_01]  134.6,14.91 90 top
F407  FUSE: 0.250A, 32V, 0.57R  [R_SMD_CHIP_1206_R_LITTLEFUSE_REV_01]  136.5,19.67 90 top
F408  FUSE: 0.250A, 32V, 0.57R  [R_SMD_CHIP_1206_R_LITTLEFUSE_REV_01]  138.41,14.91 90 top
F409  FUSE: 0.250A, 32V, 0.57R  [R_SMD_CHIP_1206_R_LITTLEFUSE_REV_01]  140.31,19.67 90 top
F410  FUSE: 0.250A, 32V, 0.57R  [R_SMD_CHIP_1206_R_LITTLEFUSE_REV_01]  142.22,14.91 90 top
F411  FUSE: 0.250A, 32V, 0.57R  [R_SMD_CHIP_1206_R_LITTLEFUSE_REV_01]  144.12,19.67 90 top
F412  FUSE: 0.250A, 32V, 0.57R  [R_SMD_CHIP_1206_R_LITTLEFUSE_REV_01]  146.03,14.91 90 top
F413  FUSE: 0.250A, 32V, 0.57R  [R_SMD_CHIP_1206_R_LITTLEFUSE_REV_01]  147.94,19.67 90 top
F414  FUSE: 0.250A, 32V, 0.57R  [R_SMD_CHIP_1206_R_LITTLEFUSE_REV_01]  149.84,14.91 90 top
F415  0.5A, 63V, 0.25R  [448_SERIES_LITTELFUSE]  153.01,17.45 90 top
F1601  1,250A_LITTELFUSE_466_1206  [R_SMD_CHIP_1206_R_LITTLEFUSE_REV_01]  10.79,13.97 90 top
IC201  0_LES_BATTERIE-MANAGEMENT.SMD_LTC6804HG-1  [0_LES_BATTERIE-MANAGEMENT.SMD_IC_SMD_SSOP-48_(G48)_R_LINEAR_REV01]  136.5,49.52 0 top
IC301  0_LES_BATTERIE-MANAGEMENT.SMD_LTC6804HG-1  [0_LES_BATTERIE-MANAGEMENT.SMD_IC_SMD_SSOP-48_(G48)_R_LINEAR_REV01]  83.17,49.52 0 top
IC801  ACPL-247-500E  [OC_SMD_SOIC-16_R_AVAGO_REV01]  103.8,54.91 180 top
IC802  ACPL-247-500E  [OC_SMD_SOIC-16_R_AVAGO_REV01]  115.23,54.91 180 top
IC803  ACPL-247-500E  [OC_SMD_SOIC-16_R_AVAGO_REV01]  61.89,54.91 180 top
IC901  ADG728BRUZ  [SOP65P638X110-16N]  97.79,17.46 180 top
IC902  ADG728BRUZ  [SOP65P638X110-16N]  8.89,64.45 180 top
IC903  LTC6255CS6  [IC_SMD_TSOT-23-6_(S6)_R_LINEAR_REV01]  104.12,19.04 180 top
IC904  LTC6255CS6  [IC_SMD_TSOT-23-6_(S6)_R_LINEAR_REV01]  26.33,62.85 270 top
IC905  ADG728BRUZ  [SOP65P638X110-16N]  18.73,64.45 180 top
IC1001  ADG728BRUZ  [SOP65P638X110-16N]  69.85,17.46 180 top
IC1002  ADG728BRUZ  [SOP65P638X110-16N]  8.89,57.15 180 top
IC1003  LTC6255CS6  [IC_SMD_TSOT-23-6_(S6)_R_LINEAR_REV01]  76.18,19.04 180 top
IC1004  LTC6255CS6  [IC_SMD_TSOT-23-6_(S6)_R_LINEAR_REV01]  26.33,56.19 270 top
IC1005  ADG728BRUZ  [SOP65P638X110-16N]  18.73,57.15 180 top
IC1101  PCA8574TS  [SOP65P640X150-20N]  87.29,17.45 90 top
IC1201  PCA8574TS  [SOP65P640X150-20N]  59.35,17.45 90 top
IC1301  M24M02-DR  [SOIC127P600X175-8N]  152.08,47.62 180 top
IC1302  MCP9800A0T-M/OT  [SOT95P280X145-5N]  109.52,48.88 180 top
IC1401  M24M02-DR  [SOIC127P600X175-8N]  98.74,47.62 180 top
IC1402  MCP9800A0T-M/OT  [SOT95P280X145-5N]  56.18,48.88 180 top
IC1601  LT8302  [S8E]  20.32,83.5 270 top
L1601  WE-74404042100  [WE-LQS]  7.62,80.96 90 top
LD201  Green  [CHIP-LED0603]  137.46,60.95 90 top
LD301  Green  [CHIP-LED0603]  84.12,60.95 90 top
R201  0,00R_0805_R_VISHAY_REV_01  [R_SMD_0805_R_VISHAY_REV01]  120.02,33.02 90 top
R202  100R, 1%, 1/10W  [R_SMD_0805_R_VISHAY_REV01]  126.34,49.52 270 top
R203  100R, 1%, 1/10W  [R_SMD_0805_R_VISHAY_REV01]  120.02,40.96 90 top
R204  120R, 1%, 1/10W  [R_SMD_0603_R_VISHAY_REV01]  49.21,27.94 0 top
R205  330R, 1%, 1/10W  [R_SMD_0603_R_VISHAY_REV01]  134.92,60.95 0 top
R206  820R, 1%, 1/10W  [R_SMD_0603_R_VISHAY_REV01]  132.46,57.45 270 top
R207  120R, 1%, 1/10W  [R_SMD_0603_R_VISHAY_REV01]  41.91,27.94 0 top
R208  1.21k, 1%, 1/10W  [R_SMD_0603_R_VISHAY_REV01]  131.03,57.45 270 top
R209  OPT  [R_SMD_0603_R_VISHAY_REV01]  145.08,59.68 180 top
R210  0R  [R_SMD_0603_R_VISHAY_REV01]  145.08,58.28 180 top
R211  OPT  [R_SMD_0603_R_VISHAY_REV01]  145.08,56.5 180 top
R212  0R  [R_SMD_0603_R_VISHAY_REV01]  145.08,55.11 180 top
R213  OPT  [R_SMD_0603_R_VISHAY_REV01]  145.08,53.33 180 top
R214  0R  [R_SMD_0603_R_VISHAY_REV01]  145.08,51.93 180 top
R215  OPT  [R_SMD_0603_R_VISHAY_REV01]  145.08,50.15 180 top
R216  0R  [R_SMD_0603_R_VISHAY_REV01]  145.08,48.76 180 top
R217  OPT  [R_SMD_0603_R_VISHAY_REV01]  145.08,46.98 180 top
R218  0R  [R_SMD_0603_R_VISHAY_REV01]  145.08,45.58 180 top
R219  1M, 10%, 1/10W  [R_SMD_0603_R_VISHAY_REV01]  133.89,57.45 90 top
R220  0R  [R_SMD_0603_R_VISHAY_REV01]  136.58,57.45 270 top
R221  OPT  [R_SMD_0603_R_VISHAY_REV01]  138.01,57.45 90 top
R222  1.2k, 10%, 1/10W  [R_SMD_0603_R_VISHAY_REV01]  147.3,49.52 90 top
R223  1.2k, 10%, 1/10W  [R_SMD_0603_R_VISHAY_REV01]  147.3,46.34 90 top
R301  0,00R_0805_R_VISHAY_REV_01  [R_SMD_0805_R_VISHAY_REV01]  66.67,33.02 90 top
R302  100R, 1%, 1/10W  [R_SMD_0805_R_VISHAY_REV01]  73,49.52 270 top
R303  100R, 1%, 1/10W  [R_SMD_0805_R_VISHAY_REV01]  66.67,40.96 90 top
R304  120R, 1%, 1/10W  [R_SMD_0603_R_VISHAY_REV01]  32.68,27.93 0 top
R305  330R, 1%, 1/10W  [R_SMD_0603_R_VISHAY_REV01]  81.58,60.95 0 top
R306  820R, 1%, 1/10W  [R_SMD_0603_R_VISHAY_REV01]  79.12,57.45 270 top
R307  120R, 1%, 1/10W  [R_SMD_0603_R_VISHAY_REV01]  25.38,27.93 0 top
R308  1.21k, 1%, 1/10W  [R_SMD_0603_R_VISHAY_REV01]  77.69,57.45 270 top
R309  OPT  [R_SMD_0603_R_VISHAY_REV01]  91.74,59.68 180 top
R310  0R  [R_SMD_0603_R_VISHAY_REV01]  91.74,58.28 180 top
R311  OPT  [R_SMD_0603_R_VISHAY_REV01]  91.74,56.5 180 top
R312  0R  [R_SMD_0603_R_VISHAY_REV01]  91.74,55.11 180 top
R313  OPT  [R_SMD_0603_R_VISHAY_REV01]  91.74,53.33 180 top
R314  0R  [R_SMD_0603_R_VISHAY_REV01]  91.74,51.93 180 top
R315  OPT  [R_SMD_0603_R_VISHAY_REV01]  91.74,50.15 180 top
R316  0R  [R_SMD_0603_R_VISHAY_REV01]  91.74,48.76 180 top
R317  OPT  [R_SMD_0603_R_VISHAY_REV01]  91.74,46.98 180 top
R318  0R  [R_SMD_0603_R_VISHAY_REV01]  91.74,45.58 180 top
R319  1M, 10%, 1/10W  [R_SMD_0603_R_VISHAY_REV01]  80.55,57.45 90 top
R320  0R  [R_SMD_0603_R_VISHAY_REV01]  83.24,57.45 270 top
R321  OPT  [R_SMD_0603_R_VISHAY_REV01]  84.67,57.45 90 top
R322  1.2k, 10%, 1/10W  [R_SMD_0603_R_VISHAY_REV01]  93.96,49.52 90 top
R323  1.2k, 10%, 1/10W  [R_SMD_0603_R_VISHAY_REV01]  93.96,46.34 90 top
R501  100R_0603_R_VISHAY_1%_TK100_REV_01  [R_SMD_0603_R_VISHAY_REV01]  136.5,29.83 90 top
R502  100R_0603_R_VISHAY_1%_TK100_REV_01  [R_SMD_0603_R_VISHAY_REV01]  139.04,29.83 90 top
R503  100R_0603_R_VISHAY_1%_TK100_REV_01  [R_SMD_0603_R_VISHAY_REV01]  141.59,29.83 90 top
R504  100R_0603_R_VISHAY_1%_TK100_REV_01  [R_SMD_0603_R_VISHAY_REV01]  144.12,29.83 90 top
R505  100R_0603_R_VISHAY_1%_TK100_REV_01  [R_SMD_0603_R_VISHAY_REV01]  146.66,29.83 90 top
R506  100R_0603_R_VISHAY_1%_TK100_REV_01  [R_SMD_0603_R_VISHAY_REV01]  149.21,29.83 90 top
R507  100R_0603_R_VISHAY_1%_TK100_REV_01  [R_SMD_0603_R_VISHAY_REV01]  151.75,29.83 90 top
R508  100R_0603_R_VISHAY_1%_TK100_REV_01  [R_SMD_0603_R_VISHAY_REV01]  121.27,29.83 90 top
R509  100R_0603_R_VISHAY_1%_TK100_REV_01  [R_SMD_0603_R_VISHAY_REV01]  123.81,29.83 90 top
R510  100R_0603_R_VISHAY_1%_TK100_REV_01  [R_SMD_0603_R_VISHAY_REV01]  126.34,29.83 90 top
R511  100R_0603_R_VISHAY_1%_TK100_REV_01  [R_SMD_0603_R_VISHAY_REV01]  128.88,29.83 90 top
R512  100R_0603_R_VISHAY_1%_TK100_REV_01  [R_SMD_0603_R_VISHAY_REV01]  131.43,29.83 90 top
R513  100R_0603_R_VISHAY_1%_TK100_REV_01  [R_SMD_0603_R_VISHAY_REV01]  133.97,29.83 90 top
R601  100R_0603_R_VISHAY_1%_TK100_REV_01  [R_SMD_0603_R_VISHAY_REV01]  83.17,29.83 90 top
R602  100R_0603_R_VISHAY_1%_TK100_REV_01  [R_SMD_0603_R_VISHAY_REV01]  85.7,29.83 90 top
R603  100R_0603_R_VISHAY_1%_TK100_REV_01  [R_SMD_0603_R_VISHAY_REV01]  88.25,29.83 90 top
R604  100R_0603_R_VISHAY_1%_TK100_REV_01  [R_SMD_0603_R_VISHAY_REV01]  90.78,29.83 90 top
R605  100R_0603_R_VISHAY_1%_TK100_REV_01  [R_SMD_0603_R_VISHAY_REV01]  93.33,29.83 90 top
R606  100R_0603_R_VISHAY_1%_TK100_REV_01  [R_SMD_0603_R_VISHAY_REV01]  95.86,29.83 90 top
R607  100R_0603_R_VISHAY_1%_TK100_REV_01  [R_SMD_0603_R_VISHAY_REV01]  98.41,29.83 90 top
R608  100R_0603_R_VISHAY_1%_TK100_REV_01  [R_SMD_0603_R_VISHAY_REV01]  67.92,29.83 90 top
R609  100R_0603_R_VISHAY_1%_TK100_REV_01  [R_SMD_0603_R_VISHAY_REV01]  70.47,29.83 90 top
R610  100R_0603_R_VISHAY_1%_TK100_REV_01  [R_SMD_0603_R_VISHAY_REV01]  73,29.83 90 top
R611  100R_0603_R_VISHAY_1%_TK100_REV_01  [R_SMD_0603_R_VISHAY_REV01]  75.55,29.83 90 top
R612  100R_0603_R_VISHAY_1%_TK100_REV_01  [R_SMD_0603_R_VISHAY_REV01]  78.08,29.83 90 top
R613  100R_0603_R_VISHAY_1%_TK100_REV_01  [R_SMD_0603_R_VISHAY_REV01]  80.62,29.83 90 top
R701  72R, 1%  [R_SMD_2010_R_YAGEO_REV01]  104.75,79.68 270 top
R702  72R, 1%  [R_SMD_2010_R_YAGEO_REV01]  111.74,79.68 270 top
R703  72R, 1%  [R_SMD_2010_R_YAGEO_REV01]  118.72,79.68 270 top
R704  72R, 1%  [R_SMD_2010_R_YAGEO_REV01]  125.71,79.68 270 top
R705  72R, 1%  [R_SMD_2010_R_YAGEO_REV01]  132.69,79.68 270 top
R706  72R, 1%  [R_SMD_2010_R_YAGEO_REV01]  139.68,79.68 270 top
R707  72R, 1%  [R_SMD_2010_R_YAGEO_REV01]  104.8,91.77 90 top
R708  72R, 1%  [R_SMD_2010_R_YAGEO_REV01]  111.78,91.77 90 top
R709  72R, 1%  [R_SMD_2010_R_YAGEO_REV01]  118.77,91.77 90 top
R710  72R, 1%  [R_SMD_2010_R_YAGEO_REV01]  125.75,91.77 90 top
R711  72R, 1%  [R_SMD_2010_R_YAGEO_REV01]  132.74,91.77 90 top
R712  72R, 1%  [R_SMD_2010_R_YAGEO_REV01]  139.72,91.77 90 top
R713  3.3k, 10%, 1/10W  [R_SMD_0603_R_VISHAY_REV01]  102.85,70.79 180 top
R714  3.3k, 10%, 1/10W  [R_SMD_0603_R_VISHAY_REV01]  109.83,70.79 180 top
R715  3.3k, 10%, 1/10W  [R_SMD_0603_R_VISHAY_REV01]  116.82,70.79 180 top
R716  3.3k, 10%, 1/10W  [R_SMD_0603_R_VISHAY_REV01]  123.81,70.79 180 top
R717  3.3k, 10%, 1/10W  [R_SMD_0603_R_VISHAY_REV01]  130.79,70.79 180 top
R718  3.3k, 10%, 1/10W  [R_SMD_0603_R_VISHAY_REV01]  137.78,70.79 180 top
R719  72R, 1%  [R_SMD_2010_R_YAGEO_REV01]  62.84,79.68 270 top
R720  72R, 1%  [R_SMD_2010_R_YAGEO_REV01]  69.83,79.68 270 top
R721  72R, 1%  [R_SMD_2010_R_YAGEO_REV01]  76.81,79.68 270 top
R722  72R, 1%  [R_SMD_2010_R_YAGEO_REV01]  83.8,79.68 270 top
R723  72R, 1%  [R_SMD_2010_R_YAGEO_REV01]  90.78,79.68 270 top
R724  72R, 1%  [R_SMD_2010_R_YAGEO_REV01]  97.77,79.68 270 top
R725  72R, 1%  [R_SMD_2010_R_YAGEO_REV01]  62.88,91.77 90 top
R726  72R, 1%  [R_SMD_2010_R_YAGEO_REV01]  69.87,91.77 90 top
R727  72R, 1%  [R_SMD_2010_R_YAGEO_REV01]  76.86,91.77 90 top
R728  72R, 1%  [R_SMD_2010_R_YAGEO_REV01]  83.84,91.77 90 top
R729  72R, 1%  [R_SMD_2010_R_YAGEO_REV01]  90.83,91.77 90 top
R730  72R, 1%  [R_SMD_2010_R_YAGEO_REV01]  97.81,91.77 90 top
R731  3.3k, 10%, 1/10W  [R_SMD_0603_R_VISHAY_REV01]  60.94,70.79 180 top
R732  3.3k, 10%, 1/10W  [R_SMD_0603_R_VISHAY_REV01]  67.92,70.79 180 top
R733  3.3k, 10%, 1/10W  [R_SMD_0603_R_VISHAY_REV01]  74.91,70.79 180 top
R734  3.3k, 10%, 1/10W  [R_SMD_0603_R_VISHAY_REV01]  81.89,70.79 180 top
R735  3.3k, 10%, 1/10W  [R_SMD_0603_R_VISHAY_REV01]  88.88,70.79 180 top
R736  3.3k, 10%, 1/10W  [R_SMD_0603_R_VISHAY_REV01]  95.86,70.79 180 top
R801  150R_0603_R_VISHAY_1%_TK100_REV_01  [R_SMD_0603_R_VISHAY_REV01]  105.71,60.31 270 top
R802  150R_0603_R_VISHAY_1%_TK100_REV_01  [R_SMD_0603_R_VISHAY_REV01]  108.25,60.31 270 top
R803  150R_0603_R_VISHAY_1%_TK100_REV_01  [R_SMD_0603_R_VISHAY_REV01]  112.06,60.31 270 top
R804  150R_0603_R_VISHAY_1%_TK100_REV_01  [R_SMD_0603_R_VISHAY_REV01]  114.6,60.31 270 top
R805  150R_0603_R_VISHAY_1%_TK100_REV_01  [R_SMD_0603_R_VISHAY_REV01]  117.14,60.31 270 top
R806  150R_0603_R_VISHAY_1%_TK100_REV_01  [R_SMD_0603_R_VISHAY_REV01]  119.68,60.31 270 top
R807  150R_0603_R_VISHAY_1%_TK100_REV_01  [R_SMD_0603_R_VISHAY_REV01]  58.72,60.31 270 top
R808  150R_0603_R_VISHAY_1%_TK100_REV_01  [R_SMD_0603_R_VISHAY_REV01]  61.26,60.31 270 top
R809  150R_0603_R_VISHAY_1%_TK100_REV_01  [R_SMD_0603_R_VISHAY_REV01]  63.8,60.31 270 top
R810  150R_0603_R_VISHAY_1%_TK100_REV_01  [R_SMD_0603_R_VISHAY_REV01]  66.34,60.31 270 top
R811  150R_0603_R_VISHAY_1%_TK100_REV_01  [R_SMD_0603_R_VISHAY_REV01]  100.63,60.31 270 top
R812  150R_0603_R_VISHAY_1%_TK100_REV_01  [R_SMD_0603_R_VISHAY_REV01]  103.17,60.31 270 top
R813  10,0K_0603_R_VISHAY_1%_TK100_REV_01  [R_SMD_0603_R_VISHAY_REV01]  120.65,49.53 270 top
R901  10,0K_0603_R_VISHAY_1%_TK100_REV_01  [R_SMD_0603_R_VISHAY_REV01]  86.95,12.05 180 top
R902  10,0K_0603_R_VISHAY_1%_TK100_REV_01  [R_SMD_0603_R_VISHAY_REV01]  89.95,12.05 180 top
R903  10,0K_0603_R_VISHAY_1%_TK100_REV_01  [R_SMD_0603_R_VISHAY_REV01]  92.95,12.05 180 top
R904  10,0K_0603_R_VISHAY_1%_TK100_REV_01  [R_SMD_0603_R_VISHAY_REV01]  95.95,12.05 180 top
R905  10,0K_0603_R_VISHAY_1%_TK100_REV_01  [R_SMD_0603_R_VISHAY_REV01]  98.95,12.05 180 top
R906  10,0K_0603_R_VISHAY_1%_TK100_REV_01  [R_SMD_0603_R_VISHAY_REV01]  101.95,12.05 180 top
R907  10,0K_0603_R_VISHAY_1%_TK100_REV_01  [R_SMD_0603_R_VISHAY_REV01]  104.95,12.05 180 top
R908  10,0K_0603_R_VISHAY_1%_TK100_REV_01  [R_SMD_0603_R_VISHAY_REV01]  107.95,12.05 180 top
R909  100R_0603_R_VISHAY_1%_TK100_REV_01  [R_SMD_0603_R_VISHAY_REV01]  104.75,21.89 180 top
R910  100R_0603_R_VISHAY_1%_TK100_REV_01  [R_SMD_0603_R_VISHAY_REV01]  25.7,65.39 0 top
R1001  10,0K_0603_R_VISHAY_1%_TK100_REV_01  [R_SMD_0603_R_VISHAY_REV01]  58.75,12.05 180 top
R1002  10,0K_0603_R_VISHAY_1%_TK100_REV_01  [R_SMD_0603_R_VISHAY_REV01]  61.75,12.05 180 top
R1003  10,0K_0603_R_VISHAY_1%_TK100_REV_01  [R_SMD_0603_R_VISHAY_REV01]  64.75,12.05 180 top
R1004  10,0K_0603_R_VISHAY_1%_TK100_REV_01  [R_SMD_0603_R_VISHAY_REV01]  67.75,12.05 180 top
R1005  10,0K_0603_R_VISHAY_1%_TK100_REV_01  [R_SMD_0603_R_VISHAY_REV01]  70.75,12.05 180 top
R1006  10,0K_0603_R_VISHAY_1%_TK100_REV_01  [R_SMD_0603_R_VISHAY_REV01]  73.75,12.05 180 top
R1007  10,0K_0603_R_VISHAY_1%_TK100_REV_01  [R_SMD_0603_R_VISHAY_REV01]  76.75,12.05 180 top
R1008  10,0K_0603_R_VISHAY_1%_TK100_REV_01  [R_SMD_0603_R_VISHAY_REV01]  79.75,12.05 180 top
R1009  100R_0603_R_VISHAY_1%_TK100_REV_01  [R_SMD_0603_R_VISHAY_REV01]  76.81,21.89 180 top
R1010  100R_0603_R_VISHAY_1%_TK100_REV_01  [R_SMD_0603_R_VISHAY_REV01]  25.7,58.73 0 top
R1101  10,0K_0603_R_VISHAY_1%_TK100_REV_01  [R_SMD_0603_R_VISHAY_REV01]  93.64,22.85 90 top
R1102  10,0K_0603_R_VISHAY_1%_TK100_REV_01  [R_SMD_0603_R_VISHAY_REV01]  92.06,22.85 90 top
R1103  10,0K_0603_R_VISHAY_1%_TK100_REV_01  [R_SMD_0603_R_VISHAY_REV01]  90.47,22.85 90 top
R1104  10,0K_0603_R_VISHAY_1%_TK100_REV_01  [R_SMD_0603_R_VISHAY_REV01]  88.88,22.85 90 top
R1105  10,0K_0603_R_VISHAY_1%_TK100_REV_01  [R_SMD_0603_R_VISHAY_REV01]  87.29,22.85 90 top
R1106  10,0K_0603_R_VISHAY_1%_TK100_REV_01  [R_SMD_0603_R_VISHAY_REV01]  85.7,22.85 90 top
R1107  10,0K_0603_R_VISHAY_1%_TK100_REV_01  [R_SMD_0603_R_VISHAY_REV01]  84.12,22.85 90 top
R1108  10,0K_0603_R_VISHAY_1%_TK100_REV_01  [R_SMD_0603_R_VISHAY_REV01]  82.53,22.85 90 top
R1201  10,0K_0603_R_VISHAY_1%_TK100_REV_01  [R_SMD_0603_R_VISHAY_REV01]  65.7,22.85 90 top
R1202  10,0K_0603_R_VISHAY_1%_TK100_REV_01  [R_SMD_0603_R_VISHAY_REV01]  64.11,22.85 90 top
R1203  10,0K_0603_R_VISHAY_1%_TK100_REV_01  [R_SMD_0603_R_VISHAY_REV01]  62.53,22.85 90 top
R1204  10,0K_0603_R_VISHAY_1%_TK100_REV_01  [R_SMD_0603_R_VISHAY_REV01]  60.94,22.85 90 top
R1205  10,0K_0603_R_VISHAY_1%_TK100_REV_01  [R_SMD_0603_R_VISHAY_REV01]  59.35,22.85 90 top
R1206  10,0K_0603_R_VISHAY_1%_TK100_REV_01  [R_SMD_0603_R_VISHAY_REV01]  57.77,22.85 90 top
R1207  10,0K_0603_R_VISHAY_1%_TK100_REV_01  [R_SMD_0603_R_VISHAY_REV01]  56.18,22.85 90 top
R1208  10,0K_0603_R_VISHAY_1%_TK100_REV_01  [R_SMD_0603_R_VISHAY_REV01]  54.59,22.85 90 top
R1301  10,0K_0603_R_VISHAY_1%_TK100_REV_01  [R_SMD_0603_R_VISHAY_REV01]  112.69,48.88 270 top
R1302  10,0K_0603_R_VISHAY_1%_TK100_REV_01  [R_SMD_0603_R_VISHAY_REV01]  152.08,51.12 0 top
R1401  10,0K_0603_R_VISHAY_1%_TK100_REV_01  [R_SMD_0603_R_VISHAY_REV01]  59.35,48.88 270 top
R1402  10,0K_0603_R_VISHAY_1%_TK100_REV_01  [R_SMD_0603_R_VISHAY_REV01]  97.47,51.59 90 top
R1601  390K_0603_R_VISHAY_1%_TK100_REV_01  [R_SMD_0603_R_VISHAY_REV01]  15.56,85.41 180 top
R1602  86,6K_0603_R_VISHAY_1%_TK100_REV_01  [R_SMD_0603_R_VISHAY_REV01]  15.56,86.84 0 top
R1603  39,0R_0805_R_VISHAY_1%_TK100_REV_01  [R_SMD_0805_R_VISHAY_REV01]  23.81,93.82 180 top
R1604  DUMMY_R_CHIP_0603_R_VISHAY  [R_SMD_0603_R_VISHAY_REV01]  24.45,84.77 270 top
R1605  127K_0603_R_VISHAY_1%_TK100_REV_01  [R_SMD_0603_R_VISHAY_REV01]  24.45,82.23 270 top
R1606  10,0K_0603_R_VISHAY_1%_TK100_REV_01  [R_SMD_0603_R_VISHAY_REV01]  22.23,86.84 0 top
SJ401  [SJ]  123.81,12.37 0 top
SJ402  [SJ]  153.01,12.37 0 top
SJ901  OPT  [CUSTOM_JUMPER_SJ]  104.12,15.54 0 top
SJ902  OPT  [CUSTOM_JUMPER_SJ]  29.82,62.85 270 top
SJ1001  OPT  [CUSTOM_JUMPER_SJ]  76.18,15.54 0 top
SJ1002  OPT  [CUSTOM_JUMPER_SJ]  29.82,56.19 270 top
T201  PBHV8115Z  [D_SMD_SOT223_(SC-73)_R_NXP_REV01]  126.36,56.83 0 top
T301  PBHV8115Z  [D_SMD_SOT223_(SC-73)_R_NXP_REV01]  73.03,56.83 0 top
T701  NX2301P  [D_SMD_SOT23_(TO-236AB)_R_NXP_REV01]  106.03,70.79 0 top
T702  NX2301P  [D_SMD_SOT23_(TO-236AB)_R_NXP_REV01]  113.01,70.79 0 top
T703  NX2301P  [D_SMD_SOT23_(TO-236AB)_R_NXP_REV01]  120,70.79 0 top
T704  NX2301P  [D_SMD_SOT23_(TO-236AB)_R_NXP_REV01]  126.98,70.79 0 top
T705  NX2301P  [D_SMD_SOT23_(TO-236AB)_R_NXP_REV01]  133.97,70.79 0 top
T706  NX2301P  [D_SMD_SOT23_(TO-236AB)_R_NXP_REV01]  140.95,70.79 0 top
T707  NX2301P  [D_SMD_SOT23_(TO-236AB)_R_NXP_REV01]  64.11,70.79 0 top
T708  NX2301P  [D_SMD_SOT23_(TO-236AB)_R_NXP_REV01]  71.1,70.79 0 top
T709  NX2301P  [D_SMD_SOT23_(TO-236AB)_R_NXP_REV01]  78.08,70.79 0 top
T710  NX2301P  [D_SMD_SOT23_(TO-236AB)_R_NXP_REV01]  85.07,70.79 0 top
T711  NX2301P  [D_SMD_SOT23_(TO-236AB)_R_NXP_REV01]  92.06,70.79 0 top
T712  NX2301P  [D_SMD_SOT23_(TO-236AB)_R_NXP_REV01]  99.04,70.79 0 top
TP201  CUSTOM_PAD_PAD_2.0X1.5MM  [CUSTOM_PAD_PAD2.0X1.5MM]  46.67,9.21 90 top
TP203  CUSTOM_PAD_PAD_2.0X1.5MM  [CUSTOM_PAD_PAD2.0X1.5MM]  148.89,57.77 0 top
TP204  CUSTOM_PAD_PAD_2.0X1.5MM  [CUSTOM_PAD_PAD2.0X1.5MM]  148.89,60.63 0 top
TP205  CUSTOM_PAD_PAD_2.0X1.5MM  [CUSTOM_PAD_PAD2.0X1.5MM]  140,60.95 180 top
TP206  CUSTOM_PAD_PAD_2.0X1.5MM  [CUSTOM_PAD_PAD2.0X1.5MM]  131.43,60.95 180 top
TP207  CUSTOM_PAD_PAD_2.0X1.5MM  [CUSTOM_PAD_PAD2.0X1.5MM]  39.69,9.21 90 top
TP209  CUSTOM_PAD_PAD_2.0X1.5MM  [CUSTOM_PAD_PAD2.0X1.5MM]  148.89,54.91 180 top
TP210  CUSTOM_PAD_PAD_2.0X1.5MM  [CUSTOM_PAD_PAD2.0X1.5MM]  148.89,52.06 180 top
TP301  CUSTOM_PAD_PAD_2.0X1.5MM  [CUSTOM_PAD_PAD2.0X1.5MM]  32.7,9.21 270 top
TP303  CUSTOM_PAD_PAD_2.0X1.5MM  [CUSTOM_PAD_PAD2.0X1.5MM]  95.55,57.77 180 top
TP304  CUSTOM_PAD_PAD_2.0X1.5MM  [CUSTOM_PAD_PAD2.0X1.5MM]  95.55,60.63 180 top
TP305  CUSTOM_PAD_PAD_2.0X1.5MM  [CUSTOM_PAD_PAD2.0X1.5MM]  86.66,60.95 0 top
TP306  CUSTOM_PAD_PAD_2.0X1.5MM  [CUSTOM_PAD_PAD2.0X1.5MM]  78.08,60.95 180 top
TP307  CUSTOM_PAD_PAD_2.0X1.5MM  [CUSTOM_PAD_PAD2.0X1.5MM]  25.72,9.21 270 top
TP309  CUSTOM_PAD_PAD_2.0X1.5MM  [CUSTOM_PAD_PAD2.0X1.5MM]  95.55,54.91 180 top
TP310  CUSTOM_PAD_PAD_2.0X1.5MM  [CUSTOM_PAD_PAD2.0X1.5MM]  95.55,52.06 180 top
TP1601  CUSTOM_PAD_PAD_2.0X1.5MM  [CUSTOM_PAD_PAD2.0X1.5MM]  13.02,77.15 270 top
TP1602  CUSTOM_PAD_PAD_2.0X1.5MM  [CUSTOM_PAD_PAD2.0X1.5MM]  6.67,77.15 90 top
TP1603  CUSTOM_PAD_PAD_2.0X1.5MM  [CUSTOM_PAD_PAD2.0X1.5MM]  40.01,77.15 90 top
TR201  HM2102NL  [HM2102NL]  45.56,19.05 0 top
TR301  HM2102NL  [HM2102NL]  29.05,19.05 0 top
TR1601  WE_750313457  [WUERTH_CUSTOM]  33.66,86.04 270 top
U$55  [FIDUCIAL_1MM]  147.5,95 0 top
U$56  [FIDUCIAL_1MM]  16.5,20 0 top
X1501  MA09-2  [MA09-2]  16.51,42.55 180 top
X1502  MA09-2  [MA09-2]  16.51,50.16 180 top
X1503  43045-2400_MOLEX_24PIN  [X_TH_MOLEX_43045-2400_R_REV01]  130.5,2.5 0 top
X1504  MA05-2  [MA05-2]  36.83,42.55 180 top
X1505  MA05-2  [MA05-2]  36.83,50.16 180 top
X1506  43045-1600_MOLEX_16PIN  [X_TH_MOLEX_43045-1600_R_REV01]  95.5,2.5 0 top
X1507  43045-1600_MOLEX_16PIN  [X_TH_MOLEX_43045-1600_R_REV01]  67.5,2.5 0 top
X1508  MA10-2  [MA10-2]  17.78,34.92 180 top
X1509  43045-0200_MOLEX_2PIN  [X_TH_MOLEX_43045-0200_R_REV01]  49,2.5 0 top
X1510  43045-0200_MOLEX_2PIN  [X_TH_MOLEX_43045-0200_R_REV01]  42,2.5 0 top
X1511  43045-0200_MOLEX_2PIN  [X_TH_MOLEX_43045-0200_R_REV01]  35,2.5 0 top
X1512  43045-0200_MOLEX_2PIN  [X_TH_MOLEX_43045-0200_R_REV01]  28,2.5 0 top
X1513  43045-0200_MOLEX_2PIN  [X_TH_MOLEX_43045-0200_R_REV01]  13,2.5 0 top
X1514  43045-0200_MOLEX_2PIN  [X_TH_MOLEX_43045-0200_R_REV01]  20,2.5 0 top
X1515  MA02-2_TH  [MA02-2]  16.51,13.97 0 top
X1601  MA02-1_TH  [MA02-1A]  44.45,76.83 180 top
Z501  6.8V, 500mW  [D_SMD_SOD-123_R_ON_REV01]  139.04,38.09 180 top
Z502  6.8V, 500mW  [D_SMD_SOD-123_R_ON_REV01]  141.59,35.55 180 top
Z503  6.8V, 500mW  [D_SMD_SOD-123_R_ON_REV01]  144.12,38.09 180 top
Z504  6.8V, 500mW  [D_SMD_SOD-123_R_ON_REV01]  146.66,35.55 180 top
Z505  6.8V, 500mW  [D_SMD_SOD-123_R_ON_REV01]  149.21,38.09 180 top
Z506  6.8V, 500mW  [D_SMD_SOD-123_R_ON_REV01]  151.75,35.55 180 top
Z507  6.8V, 500mW  [D_SMD_SOD-123_R_ON_REV01]  123.81,38.09 180 top
Z508  6.8V, 500mW  [D_SMD_SOD-123_R_ON_REV01]  126.34,35.55 180 top
Z509  6.8V, 500mW  [D_SMD_SOD-123_R_ON_REV01]  128.88,38.09 180 top
Z510  6.8V, 500mW  [D_SMD_SOD-123_R_ON_REV01]  131.43,35.55 180 top
Z511  6.8V, 500mW  [D_SMD_SOD-123_R_ON_REV01]  133.97,38.09 180 top
Z512  6.8V, 500mW  [D_SMD_SOD-123_R_ON_REV01]  136.5,35.55 180 top
Z601  6.8V, 500mW  [D_SMD_SOD-123_R_ON_REV01]  85.7,38.09 180 top
Z602  6.8V, 500mW  [D_SMD_SOD-123_R_ON_REV01]  88.25,35.55 180 top
Z603  6.8V, 500mW  [D_SMD_SOD-123_R_ON_REV01]  90.78,38.09 180 top
Z604  6.8V, 500mW  [D_SMD_SOD-123_R_ON_REV01]  93.33,35.55 180 top
Z605  6.8V, 500mW  [D_SMD_SOD-123_R_ON_REV01]  95.86,38.09 180 top
Z606  6.8V, 500mW  [D_SMD_SOD-123_R_ON_REV01]  98.41,35.55 180 top
Z607  6.8V, 500mW  [D_SMD_SOD-123_R_ON_REV01]  70.47,38.09 180 top
Z608  6.8V, 500mW  [D_SMD_SOD-123_R_ON_REV01]  73,35.55 180 top
Z609  6.8V, 500mW  [D_SMD_SOD-123_R_ON_REV01]  75.55,38.09 180 top
Z610  6.8V, 500mW  [D_SMD_SOD-123_R_ON_REV01]  78.08,35.55 180 top
Z611  6.8V, 500mW  [D_SMD_SOD-123_R_ON_REV01]  80.62,38.09 180 top
Z612  6.8V, 500mW  [D_SMD_SOD-123_R_ON_REV01]  83.17,35.55 180 top

## Tracks (layer width: path | path; a pad name or v marks a point on that pad's centre or on a via)
+3.0V_VREF1_0  (via drill 0.3)
  Top 0.152: TP203.P$1 147.62,57.77 147.3,57.45 143.81,57.45 v143.49,57.14 | IC201.35 137.25,52.17 v136.82,51.74
  Top 0.254: C206.2 139.36,55.23 139.04,54.91 137.57,54.91 137.25,54.6 IC201.35
  Signals2 0.152: v136.82,51.74 136.82,51.42 137.14,51.1 143.17,51.1 143.49,51.42 v143.49,57.14
+3.0V_VREF1_1  (via drill 0.3)
  Top 0.152: TP303.P$1 94.28,57.77 93.96,57.45 v90.15,57.45 | 83.92,54.71 83.92,55.66 v84.12,55.87
  Top 0.254: IC301.35 83.92,54.71 84.75,55.55 85.7,55.55 86.02,55.87 C306.2
  Bottom 0.152: v90.15,57.45 89.83,57.14 89.83,56.19 89.52,55.87 v84.12,55.87
+3.0V_VREF2_0  (via drill 0.3)
  Top 0.152: v106.98,11.1 107.2,11.32 R908.2 107.2,12.75 107.47,13.02 108.49,13.02 C901.2 | R907.2 104.2,11.18 v104.12,11.1 | R906.2 101.2,11.16 v101.26,11.1 | R905.2 98.2,11.22 v98.09,11.1 | R904.2 95.2,11.39 v94.91,11.1 | R902.2 v89.2,11.11 v89.2,11.1 | R901.2 86.2,11.24 v86.34,11.1 | R903.2 92.2,11.25 v92.06,11.1 | TP204.P$1 143.17,60.63 v142.54,59.99
  Top 0.254: 29.21,37.43 29.28,37.37 C1506.2 32.13,37.37 32.37,37.13 v32.37,34.28 | IC201.34 137.75,53.94 138.09,54.28 v139.04,54.28 140.63,55.87 C205.2 | C901.2 107.84,13.41 v107.61,13.64 | X1501.17 5.39,43.81 5.06,43.48 5.06,39.36 5.38,39.04 C1501.2 5.78,38.32 6.01,38.09 22.52,38.09 23.79,39.36 28.87,39.36 29.19,39.04 29.19,37.45 29.21,37.43 | X1508.1 29.21,37.43
  Signals1 0.254: v107.61,13.64 v107.61,22.85 107.61,23.5 107.93,23.81 113.98,23.81 114.28,24.11 114.28,53.65 114.6,53.96 128.89,53.96 129.54,54.61 138.72,54.61 v139.04,54.28
  Signals2 0.152: v142.54,59.99 142.54,58.09 142.22,57.77 139.68,57.77 139.04,57.14 v139.04,54.28
  Bottom 0.152: v106.98,11.1 v104.12,11.1 v101.26,11.1 v98.09,11.1 v94.91,11.1 v92.06,11.1 v89.2,11.1 v86.34,11.1
  Bottom 0.254: v32.37,34.28 32.37,32.69 32.68,32.37 53,32.37 53.32,32.05 53.32,24.79 53.66,24.45 66.67,24.45 67.48,23.64 106.82,23.64 v107.61,22.85
+3.0V_VREF2_1  (via drill 0.3)
  Top 0.152: v78.72,11.1 79,11.38 R1008.2 79.03,12.05 79.03,12.68 79.38,13.02 80.55,13.02 C1001.2 | R1001.2 58,11.19 v58.08,11.1 | R1002.2 61,11.16 v60.94,11.1 | R1003.2 64,11.3 v63.8,11.1 | R1004.2 67,11.12 v66.97,11.1 | R1005.2 70,11.27 v69.83,11.1 | R1006.2 v73,11.11 v73,11.1 | R1007.2 76,11.23 v75.86,11.1 | TP304.P$1 89.52,60.63 89.2,60.31 89.2,55.23 v88.88,54.91
  Top 0.254: IC301.34 84.42,54.26 85.07,54.91 v86.97,54.91 87.29,55.23 C305.2 | C1001.2 79.9,13.41 v79.67,13.64 | 33,32.37 33,37.77 32.37,38.41 30.14,38.41 29.82,38.72 29.82,39.67 29.51,39.99 28.55,39.99 28.24,40.31 28.24,45.39 27.92,45.71 6.01,45.71 5.78,45.94 C1502.2 5.38,46.66 5.06,46.98 5.06,51.1 5.39,51.44 X1502.17 | 33,32.37 53,32.37 53.32,32.05 v53.32,23.64 | 33,32.37 31.5,32.37 C1507.2 29.51,32.46 29.21,32.76 X1508.2
  Signals1 0.254: v79.67,13.64 v79.67,22.85 79.69,22.87 79.69,29.53 80.01,29.84 80.01,51.12 79.69,51.44 79.69,54.29 80.01,54.61 86.68,54.61 v86.97,54.91
  Bottom 0.152: v78.72,11.1 v75.86,11.1 v73,11.1 v69.83,11.1 v66.97,11.1 v63.8,11.1 v60.94,11.1 v58.08,11.1 | v88.88,54.91 v86.97,54.91
  Bottom 0.254: v79.67,22.85 79.07,22.85 78.74,23.18 66.99,23.18 66.67,23.5 53.47,23.5 v53.32,23.64
+5.0V_VREG_0  (via drill 0.3)
  Top 0.152: R1101.2 v93.64,22.85 | R1102.2 v92.06,22.85 | R1103.2 v90.47,22.85 | R1104.2 v88.88,22.85 | R1105.2 v87.29,22.85 | R1106.2 v85.7,22.85 | R1107.2 v84.12,22.85 | R1108.2 v82.53,22.85 | LD201.A TP205.P$1 v142.54,60.95 | R221.2 138.01,58.8 137.78,59.04 v136.82,59.04 | R219.2 133.89,58.8 133.65,59.04 v133.33,59.04 | IC904.6 28.24,63.8 28.55,63.49 28.55,60.63 28.24,60.31 C907.2 27.52,60.4 v26.65,61.27 | IC1302.1 109.85,47.94 108.65,46.75 C1302.2 108.65,45.3 v108.88,45.07 | IC201.40 134.75,51.59 135.24,51.1 135.87,51.1 136.25,51.49 IC201.37 | v105.07,46.98 | R1301.2 v112.69,47.3 | IC901.2 101.88,15.84 v101.92,15.88 | IC902.13 5.4,64.12 5.08,63.8 5.08,63.14 5.4,62.83 IC902.15 | IC905.16 16.45,62.17 16.83,62.55 16.83,63.82 16.52,64.12 IC905.13 | IC902.2 12.82,62.83 v12.86,62.87 | IC905.2 22.66,62.83 v22.7,62.87 | C903.2 8.23,60.98
  Top 0.254: IC903.6 106.22,17.73 C906.2 v106.66,17.13 | R223.2 v147.3,46.34 | R222.2 v147.3,49.52 | IC1101.5 86.96,16.51 86.66,16.82 84.44,16.82 84.2,16.59 C1101.2 v82.85,15.54 | IC201.37 136.25,54.53 135.24,55.55 C203.2 135.24,55.87 v134.6,55.23 | C1503.2 30.37,43.4 30.79,43.81 X1504.9 | C1505.2 26.67,38.3 X1508.3 | D801.2 v105.07,46.98 | v97.79,14.29 97.48,13.98 C902.2 96.77,16.58 96.22,17.13 IC901.13 | C903.2 8.47,63.8 8.15,64.12 IC902.13 | IC905.13 14.81,64.12 C908.2 14.27,65.42 v13.97,65.72 | 8.23,60.98 7.62,61.59 v7.62,62.23 | IC1301.8 150.81,45.72 151.2,45.34 C1301.2 v150.19,44.12 v150.18,44.13 | R1302.2 152.83,51.95 152.4,52.39 v150.5,52.39
  Top 0.305: T201.3 129.5,53.62 v129.84,53.96
  V_REG 0.152: v93.64,22.85 93.96,22.85 | v92.06,22.85 92.37,22.85 | v90.47,22.85 90.78,22.85 | v88.88,22.85 89.2,22.85 | v87.29,22.85 87.61,22.85 | v85.7,22.85 86.02,22.85 | v84.12,22.85 84.44,22.85 | v82.53,22.85 82.85,22.85 | v142.54,60.95 143.17,60.95 | v136.82,59.04 136.82,59.68 | v133.33,59.04 132.69,59.04 | v26.65,61.27 26.65,61.9 | v108.88,45.07 109.52,45.07 | v112.69,47.3 112.69,46.66 | v101.92,15.88 102.23,15.88 | v12.86,62.87 13.34,62.87 | v22.7,62.87 23.18,62.87
  V_REG 0.254: v106.66,17.13 107.61,17.13 | v147.3,46.34 146.66,46.34 | v147.3,49.52 146.66,49.52 | v82.85,15.54 83.48,15.54 | v134.6,55.23 133.97,55.23 | v105.07,46.98 105.07,46.34 | v97.79,14.29 97.79,14.92 | v13.97,65.72 13.97,66.36 | v7.62,62.23 7.62,62.87 | v150.18,44.13 149.54,44.13 | v150.5,52.39 150.5,53.02
  V_REG 0.305: v129.84,53.96 130.47,53.96
  pour V_REG (isolate 0.254): 160,0 160,69.73 arc90 158.73,71 1.27,71 arc90 0,69.73 -0.02,61.9 arc90 1.25,60.63 31.73,60.63 arc-97 33,59.36 33,55.55 arc90 34.27,54.28 43.8,54.28 arc-90 45.06,53.01 45.06,46.66 arc-90 43.8,45.39 6.33,45.39 arc90 5.06,44.12 5.06,36.82 arc90 6.33,35.55 45.7,35.55 arc90 46.97,36.82 46.97,63.8 arc-90 48.24,65.08 100.29,65.08 arc-90 101.56,63.81 101.6,29.83 arc-90 100.33,28.56 82.95,28.57 arc45 82.27,28.29 arc45 81.89,27.39 81.89,1.27 arc90 83.17,0
+5.0V_VREG_1  (via drill 0.3)
  Top 0.152: R1208.2 v54.59,22.85 | R1207.2 v56.18,22.85 | R1206.2 v57.77,22.85 | R1205.2 v59.35,22.85 | R1204.2 v60.94,22.85 | R1203.2 v62.53,22.85 | R1202.2 v64.11,22.85 | R1201.2 v65.7,22.85 | R321.2 84.67,58.8 v84.44,59.04 | LD301.A TP305.P$1 v88.25,60.95 | IC1004.6 28.24,57.14 28.55,56.82 28.55,54.93 28.87,54.61 30.05,54.61 30.37,54.29 C1007.2 30.37,51.83 30.78,51.42 | 54.99,16.5 C1201.2 | IC1402.1 56.51,47.94 55.31,46.75 C1402.2 55.31,45.62 v55.54,45.39 | R1401.2 v59.35,47.3 | IC301.40 81.42,51.59 81.89,51.1 82.53,51.1 82.92,51.49 IC301.37 | R319.2 80.55,58.8 80.31,59.04 v79.67,59.04 | v103.17,46.98 | IC1001.2 73.94,15.84 v73.98,15.88 | IC1005.2 22.66,55.52 v22.7,55.56 | IC1002.13 5.38,56.82 5.08,56.52 5.08,55.88 5.44,55.52 IC1002.15 | IC1005.16 15.84,54.57 15.56,54.29 v14.61,54.29 | IC1002.2 12.82,55.52 v12.86,55.56
  Top 0.254: IC1003.6 78.28,17.73 C1006.2 v78.72,17.13 | R323.2 v93.96,46.34 | IC1201.5 59.02,16.51 58.72,16.82 56.49,16.82 56.18,16.5 54.99,16.5 | C1201.2 v54.91,15.54 | 81.89,55.87 81.89,55.55 82.92,54.53 IC301.37 | T301.3 76.47,53.62 v76.81,53.96 | C1504.2 30.37,51.02 30.78,51.42 30.79,51.44 X1505.9 | R322.2 v93.96,49.52 | C303.2 81.89,55.87 | 81.89,55.87 v81.26,55.23 | C1508.2 26.67,31.53 X1508.4 | D801.1 v103.17,46.98 | IC1001.13 68.51,17.13 68.83,16.82 C1002.2 69.55,13.98 v69.85,14.29 | IC1002.13 8.15,56.82 8.47,56.5 C1003.2 9.19,53.68 10,52.86 11.27,52.86 v11.43,52.7 | IC1005.13 14.81,56.82 C1008.2 14.27,58.08 v14.61,58.42 | IC1401.8 97.47,45.72 97.86,45.34 C1401.2 v96.85,44.12 v96.84,44.13 | R1402.2 v97.47,53.34
  V_REG 0.152: v54.59,22.85 54.91,22.85 | v56.18,22.85 56.49,22.85 | v57.77,22.85 58.08,22.85 | v59.35,22.85 59.67,22.85 | v60.94,22.85 61.26,22.85 | v62.53,22.85 62.84,22.85 | v64.11,22.85 64.43,22.85 | v65.7,22.85 66.02,22.85 | v84.44,59.04 83.8,59.04 | v88.25,60.95 88.88,60.95 | v59.35,47.3 59.35,46.66 | v55.54,45.39 56.18,45.39 | v79.67,59.04 79.04,59.04 | v73.98,15.88 74.61,15.88 | v22.7,55.56 23.18,55.56 | v14.61,54.29 14.61,53.98 | v12.86,55.56 13.18,55.56
  V_REG 0.254: v78.72,17.13 78.72,16.5 | v93.96,46.34 93.33,46.34 | v54.91,15.54 54.91,14.91 | v81.26,55.23 80.62,55.23 | v76.81,53.96 77.45,53.96 | v93.96,49.52 94.59,49.52 | v69.85,14.29 69.85,14.92 | v11.43,52.7 12.06,52.7 | v14.61,58.42 14.61,59.05 | v103.17,46.98 103.17,44.75 102.87,44.45 100.65,44.45 | v96.84,44.13 96.2,44.13 | v97.47,53.34 97.47,53.98
  pour V_REG (isolate 0.254, rank 2): 0,0 20.21,0 arc90 21.48,1.27 21.48,23.73 arc-90 22.75,25 51.98,25 arc-90 53.26,23.73 53.26,1.27 arc90 54.52,0 80.01,0 arc90 81.28,1.27 81.29,27.94 arc-90 82.56,29.21 99.7,29.21 arc82 100.97,30.48 100.97,63.18 arc90 99.69,64.45 48.9,64.45 arc90 47.62,63.18 47.62,36.2 arc-90 46.35,34.92 5.71,34.92 arc-90 4.45,36.2 4.45,44.77 arc-90 5.71,46.04 43.18,46.04 arc90 44.45,47.31 44.45,52.39 arc90 43.18,53.66 33.66,53.66 arc-90 32.38,54.93 32.38,58.75 arc90 31.12,60.02 1.27,60.02 arc85 0,58.75
CELL0_FEEDBACK+  (via drill 0.3)
  Top 0.152: T706.3 140.95,69.52 140.63,69.2 135.55,69.2 134.92,68.57 129.2,68.57 128.57,67.93 122.85,67.93 122.22,67.3 120,67.3 119.68,66.98 R806.1
  Signals2 0.406: v137.78,77.14 137.17,77.14 136.84,77.47 136.84,82.23 136.53,82.55 136.53,93.98 136.84,94.3 137.76,94.3 v137.78,94.28
  other vias: 139.68,75.87 138.41,75.87 137.14,75.87 140.95,75.87 142.22,75.87 141.59,77.14 141.59,74.6 140.31,74.6 139.04,74.6 137.78,74.6 141.59,94.28 137.14,95.56 138.41,95.56 139.68,95.56 140.95,95.56 142.22,95.56 141.59,96.83 140.31,96.83 139.04,96.83 137.78,96.83
  pour Top (no thermals): 142.85,72.06 136.5,72.06 136.5,79.05 142.85,79.05
  pour Bottom (no thermals): 142.85,72.06 136.5,72.06 136.5,79.05 142.85,79.05
  pour Top (no thermals): 142.85,92.38 136.5,92.38 136.5,99.36 142.85,99.36
CELL0_FEEDBACK+1
  pour Bottom (no thermals): 142.85,92.38 136.5,92.38 136.5,99.36 142.85,99.36
CELL1_FEEDBACK+  (via drill 0.3)
  Top 0.152: T705.3 133.97,69.52 133.65,69.2 128.57,69.2 127.93,68.57 122.22,68.57 121.58,67.93 117.45,67.93 117.14,67.61 R805.1
  Signals2 0.406: v130.79,77.14 130.19,77.14 129.86,77.47 129.86,82.23 129.54,82.55 129.54,93.98 129.86,94.3 130.8,94.3 | 130.81,94.3 130.8,94.3 | 130.8,94.3 v130.79,94.28
  other vias: 132.69,75.87 133.97,75.87 135.24,75.87 134.6,77.14 131.43,75.87 130.16,75.87 130.79,74.6 132.06,74.6 133.33,74.6 134.6,74.6 134.6,94.28 130.16,95.56 131.43,95.56 132.69,95.56 133.97,95.56 135.24,95.56 134.6,96.83 133.33,96.83 132.06,96.83 130.79,96.83
  pour Top (no thermals): 129.52,72.06 129.52,79.05 135.87,79.05 135.87,72.06
  pour Bottom (no thermals): 129.52,72.06 129.52,79.05 135.87,79.05 135.87,72.06
  pour Top (no thermals): 129.52,92.38 129.52,99.36 135.87,99.36 135.87,92.38
CELL1_FEEDBACK+1
  pour Bottom (no thermals): 129.52,92.38 129.52,99.36 135.87,99.36 135.87,92.38
CELL2_FEEDBACK+  (via drill 0.3)
  Top 0.152: R804.1 114.6,67.93 115.23,68.57 120.95,68.57 121.58,69.2 126.66,69.2 126.98,69.52 T704.3
  Signals2 0.406: v123.81,77.14 123.2,77.14 122.87,77.47 122.87,82.23 122.56,82.55 122.56,93.98 122.87,94.3 123.79,94.3 v123.81,94.28
  other vias: 125.71,75.87 126.98,75.87 128.25,75.87 127.61,77.14 124.44,75.87 123.17,75.87 123.81,74.6 125.08,74.6 126.34,74.6 127.61,74.6 127.61,94.28 123.17,95.56 124.44,95.56 125.71,95.56 126.98,95.56 128.25,95.56 127.61,96.83 126.34,96.83 125.08,96.83 123.81,96.83
  pour Top (no thermals): 122.53,72.06 122.53,79.05 128.88,79.05 128.88,72.06
  pour Bottom (no thermals): 122.53,72.06 122.53,79.05 128.88,79.05 128.88,72.06
  pour Top (no thermals): 122.53,92.38 122.53,99.36 128.88,99.36 128.88,92.38
CELL2_FEEDBACK+1
  pour Bottom (no thermals): 122.53,92.38 122.53,99.36 128.88,99.36 128.88,92.38
CELL3_FEEDBACK+  (via drill 0.3)
  Top 0.152: T703.3 120,69.52 119.68,69.2 114.6,69.2 113.96,68.57 112.38,68.57 112.06,68.25 R803.1